# EAGLE schematic pdp8i (EAGLE 6.6.0), part 4 of 4
## Sheet 30 of 40
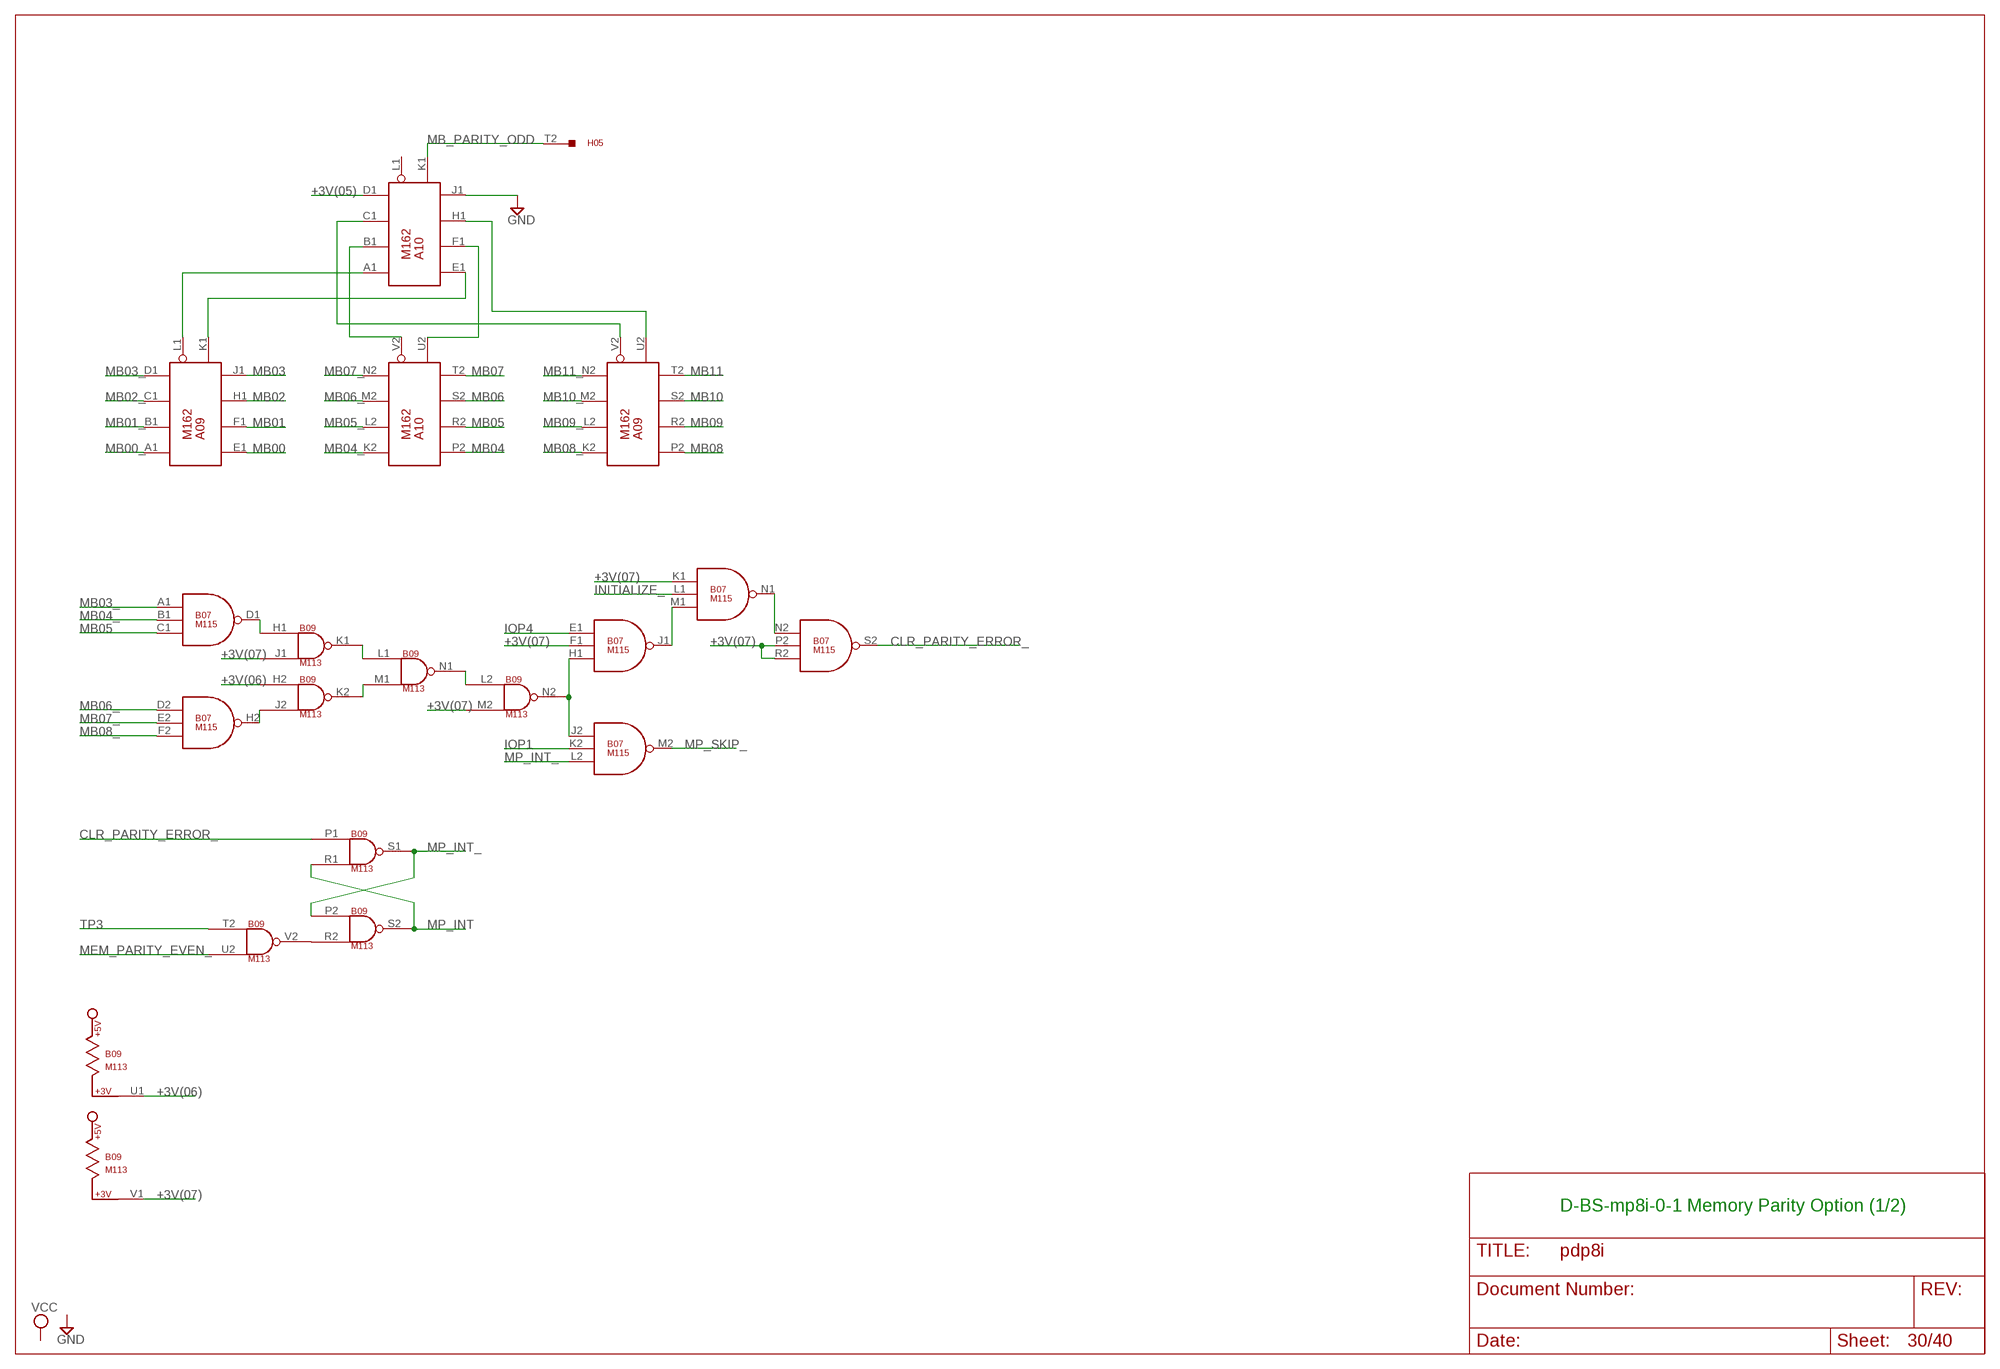
[diagram p30: schematic, sheet 30]

### Parts
A09  M162  [H807]
A10  M162  [H807]
B07  M115  [H807]
B09  M113  [H807]

### Nets
+3V(05): A10.D1(K1:8B) ; also sheet 31
+3V(06): B09.H2(K2:IN1) B09.U1 ; also sheet 31
+3V(07): B07.F1(J1:IN2) B07.K1(N1:IN1) B07.P2(S2:IN2) B07.R2(S2:IN3) B09.J1(K1:IN2) B09.M2(N2:IN2) B09.V1
CLR_PARITY_ERROR_: B07.S2(S2:OUT) B09.P1(S1:IN1)
GND [Suppply]: A10.J1(K1:8A) ; also sheet 2,5,9,10,11,12,13,14,15,17,18,23,26,27,33,34,35,39
INITIALIZE_: B07.L1(N1:IN2) ; also sheet 2,14,26,32,35,36,37,38,39
IOP1: B07.K2(M2:IN2) ; also sheet 2,15,16,33,34,35,36
IOP4: B07.E1(J1:IN1) ; also sheet 2,15,16,33,34,35,36
MB00: A09.E1(K1:1A) ; also sheet 9,14,21
MB00_: A09.A1(K1:1B) ; also sheet 9,18,23
MB01: A09.F1(K1:2A) ; also sheet 9,14,21
MB01_: A09.B1(K1:2B) ; also sheet 9,18,23
MB02: A09.H1(K1:4A) ; also sheet 9,14,21
MB02_: A09.C1(K1:4B) ; also sheet 9,18,23
MB03: A09.J1(K1:8A) ; also sheet 4,5,9,14,21,27,29,34,38
MB03_: A09.D1(K1:8B) B07.A1(D1:IN1) ; also sheet 4,5,6,7,8,9,14,15,16,18,22,23,32,33,35,36,37
MB04: A10.P2(U2:1A) ; also sheet 5,9,14,21,22,38
MB04_: A10.K2(U2:1B) B07.B1(D1:IN2) ; also sheet 5,8,9,14,15,16,18,23,27,29,32,33,34,35,36,37
MB05: A10.R2(U2:2A) B07.C1(D1:IN3) ; also sheet 5,7,9,14,21,27,32,34,37
MB05_: A10.L2(U2:2B) ; also sheet 5,8,9,14,15,16,18,22,23,29,33,35,36,38
MB06: A10.S2(U2:4A) ; also sheet 5,7,9,14,16,21,22,27,33,38
MB06_: A10.M2(U2:4B) B07.D2(H2:IN1) ; also sheet 5,8,9,14,15,18,22,23,29,32,34,35,36,37,38
MB07: A10.T2(U2:8A) ; also sheet 5,7,9,14,15,21,22,26,27,33,34,35,37,38
MB07_: A10.N2(U2:8B) B07.E2(H2:IN2) ; also sheet 5,8,9,14,16,18,22,23,26,28,29,32,33,34,36
MB08: A09.P2(U2:1A) ; also sheet 6,7,9,14,15,21,22,26,27,33,34,36,37,38
MB08_: A09.K2(U2:1B) B07.F2(H2:IN3) ; also sheet 6,7,8,9,14,16,18,22,23,26,28,29,32,33,34,35
MB09: A09.R2(U2:2A) ; also sheet 2,5,6,9,14,21,22,27,29,37
MB09_: A09.L2(U2:2B) ; also sheet 6,9,18,23,26,27,28,33,37
MB10: A09.S2(U2:4A) ; also sheet 2,6,8,9,14,21,22,27,29,33,37
MB10_: A09.M2(U2:4B) ; also sheet 6,8,9,18,22,23,26,27,28,37
MB11: A09.T2(U2:8A) ; also sheet 2,6,9,14,21,22,27,29,33,37
MB11_: A09.N2(U2:8B) ; also sheet 2,5,7,8,9,18,22,23,26,28,29
MB_PARITY_ODD: A10.K1(K1:ODD) H05.T2 ; also sheet 18
MEM_PARITY_EVEN_: B09.U2(V2:IN2) ; also sheet 31
MP_INT: B09.R1(S1:IN2) B09.S2(S2:OUT)
MP_INT_: B07.L2(M2:IN3) B09.P2(S2:IN1) B09.S1(S1:OUT) ; also sheet 14
MP_SKIP_: B07.M2(M2:OUT) ; also sheet 14
N$262: A09.L1(K1:EVEN) A10.A1(K1:1B)
N$687: A09.K1(K1:ODD) A10.E1(K1:1A)
N$689: A10.B1(K1:2B) A10.V2(U2:EVEN)
N$690: A10.F1(K1:2A) A10.U2(U2:ODD)
N$691: A09.V2(U2:EVEN) A10.C1(K1:4B)
N$692: A09.U2(U2:ODD) A10.H1(K1:4A)
N$693: B07.D1(D1:OUT) B09.H1(K1:IN1)
N$694: B07.H2(H2:OUT) B09.J2(K2:IN2)
N$695: B09.K1(K1:OUT) B09.L1(N1:IN1)
N$696: B09.K2(K2:OUT) B09.M1(N1:IN2)
N$697: B07.H1(J1:IN3) B07.J2(M2:IN1) B09.N2(N2:OUT)
N$698: B09.L2(N2:IN1) B09.N1(N1:OUT)
N$699: B07.J1(J1:OUT) B07.M1(N1:IN3)
N$700: B07.N1(N1:OUT) B07.N2(S2:IN1)
N$701: B09.R2(S2:IN2) B09.V2(V2:OUT)
TP3: B09.T2(V2:IN1) ; also sheet 2,7,21,22,26,27,29
Unconnected: A10.L1(K1:EVEN) B07.P1(U1:IN1) B07.R1(U1:IN2) B07.S1(U1:IN3) B07.T2(V1:IN1) B07.U1(U1:OUT) B07.U2(V1:IN2) B07.V1(V1:OUT) B07.V2(V1:IN3)

### Notes on the sheet
- D-BS-mp8i-0-1 Memory Parity Option (1/2)

## Sheet 31 of 40
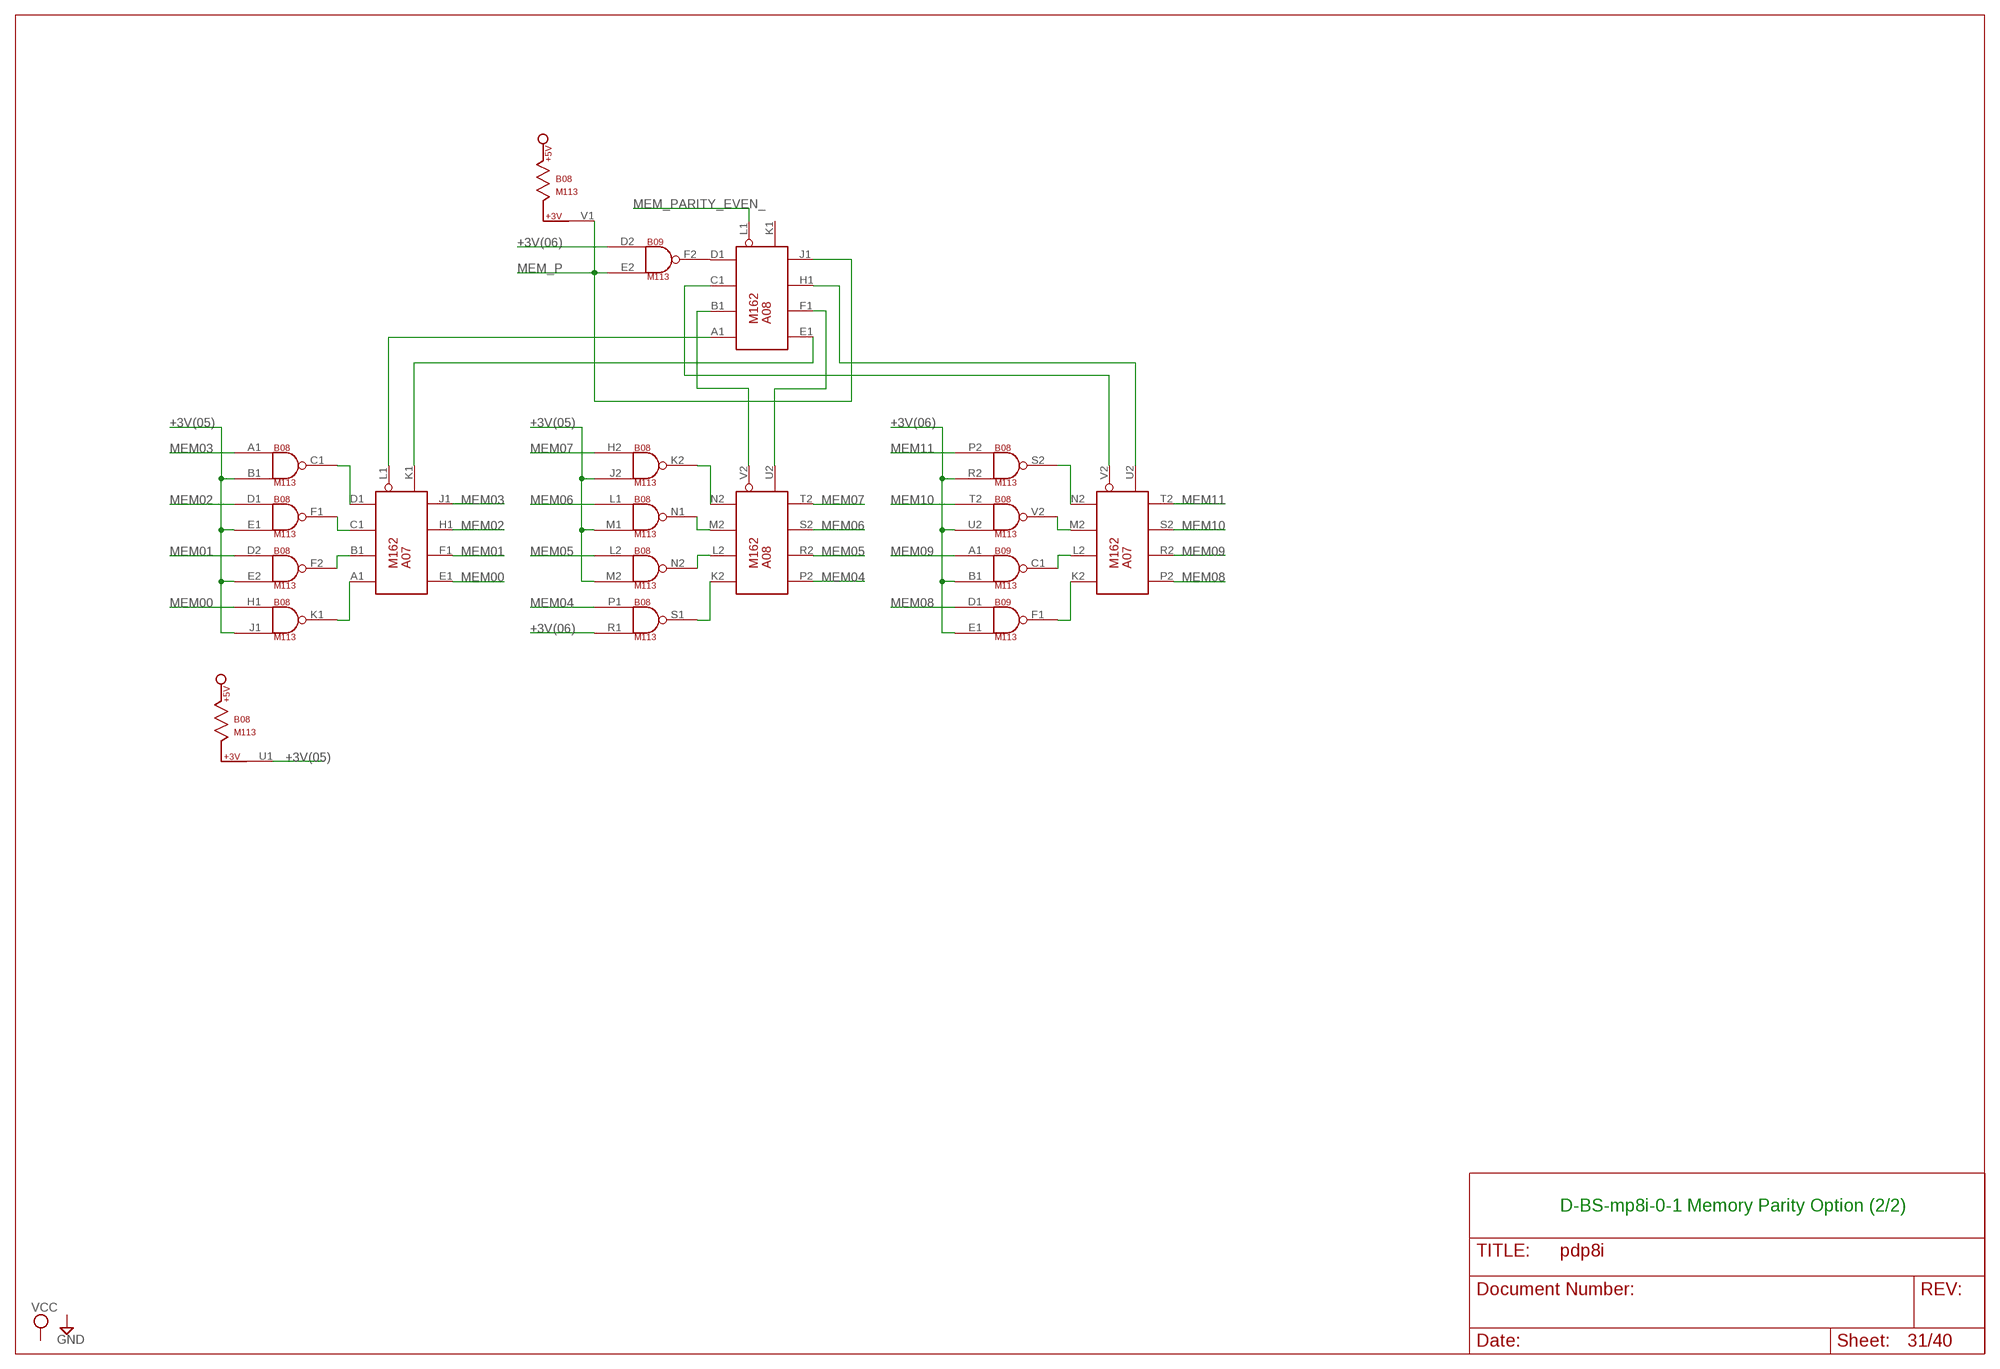
[diagram p31: schematic, sheet 31]

### Parts
A07  M162  [H807]
A08  M162  [H807]
B08  M113  [H807]

### Nets
+3V(05): B08.B1(C1:IN2) B08.E1(F1:IN2) B08.E2(F2:IN2) B08.J1(K1:IN2) B08.J2(K2:IN2) B08.M1(N1:IN2) B08.M2(N2:IN2) B08.U1 ; also sheet 30
+3V(06): B08.R1(S1:IN2) B08.R2(S2:IN2) B08.U2(V2:IN2) B09.B1(C1:IN2) B09.D2(F2:IN1) B09.E1(F1:IN2) ; also sheet 30
MEM00: A07.E1(K1:1A) B08.H1(K1:IN1) ; also sheet 4,10,18,29
MEM01: A07.F1(K1:2A) B08.D2(F2:IN1) ; also sheet 4,10,18
MEM02: A07.H1(K1:4A) B08.D1(F1:IN1) ; also sheet 4,10,18
MEM03: A07.J1(K1:8A) B08.A1(C1:IN1) ; also sheet 11,18
MEM04: A08.P2(U2:1A) B08.P1(S1:IN1) ; also sheet 11,18
MEM05: A08.R2(U2:2A) B08.L2(N2:IN1) ; also sheet 11,18
MEM06: A08.S2(U2:4A) B08.L1(N1:IN1) ; also sheet 12,18
MEM07: A08.T2(U2:8A) B08.H2(K2:IN1) ; also sheet 12,18
MEM08: A07.P2(U2:1A) B09.D1(F1:IN1) ; also sheet 12,18
MEM09: A07.R2(U2:2A) B09.A1(C1:IN1) ; also sheet 13,18,29
MEM10: A07.S2(U2:4A) B08.T2(V2:IN1) ; also sheet 13,18
MEM11: A07.T2(U2:8A) B08.P2(S2:IN1) ; also sheet 13,18
MEM_P: A08.J1(K1:8A) B08.V1 B09.E2(F2:IN2) ; also sheet 18
MEM_PARITY_EVEN_: A08.L1(K1:EVEN) ; also sheet 30
N$702: A07.L1(K1:EVEN) A08.A1(K1:1B)
N$703: A07.K1(K1:ODD) A08.E1(K1:1A)
N$704: A08.B1(K1:2B) A08.V2(U2:EVEN)
N$705: A08.F1(K1:2A) A08.U2(U2:ODD)
N$706: A07.V2(U2:EVEN) A08.C1(K1:4B)
N$707: A07.U2(U2:ODD) A08.H1(K1:4A)
N$708: A08.M2(U2:4B) B08.N1(N1:OUT)
N$709: A08.L2(U2:2B) B08.N2(N2:OUT)
N$710: A08.K2(U2:1B) B08.S1(S1:OUT)
N$711: A08.N2(U2:8B) B08.K2(K2:OUT)
N$712: A07.M2(U2:4B) B08.V2(V2:OUT)
N$713: A07.B1(K1:2B) B08.F2(F2:OUT)
N$714: A07.C1(K1:4B) B08.F1(F1:OUT)
N$715: A07.D1(K1:8B) B08.C1(C1:OUT)
N$716: A07.A1(K1:1B) B08.K1(K1:OUT)
N$717: A07.L2(U2:2B) B09.C1(C1:OUT)
N$718: A07.K2(U2:1B) B09.F1(F1:OUT)
N$719: A07.N2(U2:8B) B08.S2(S2:OUT)
N$720: A08.D1(K1:8B) B09.F2(F2:OUT)
Unconnected: A08.K1(K1:ODD)

### Notes on the sheet
- D-BS-mp8i-0-1 Memory Parity Option (2/2)

## Sheet 32 of 40
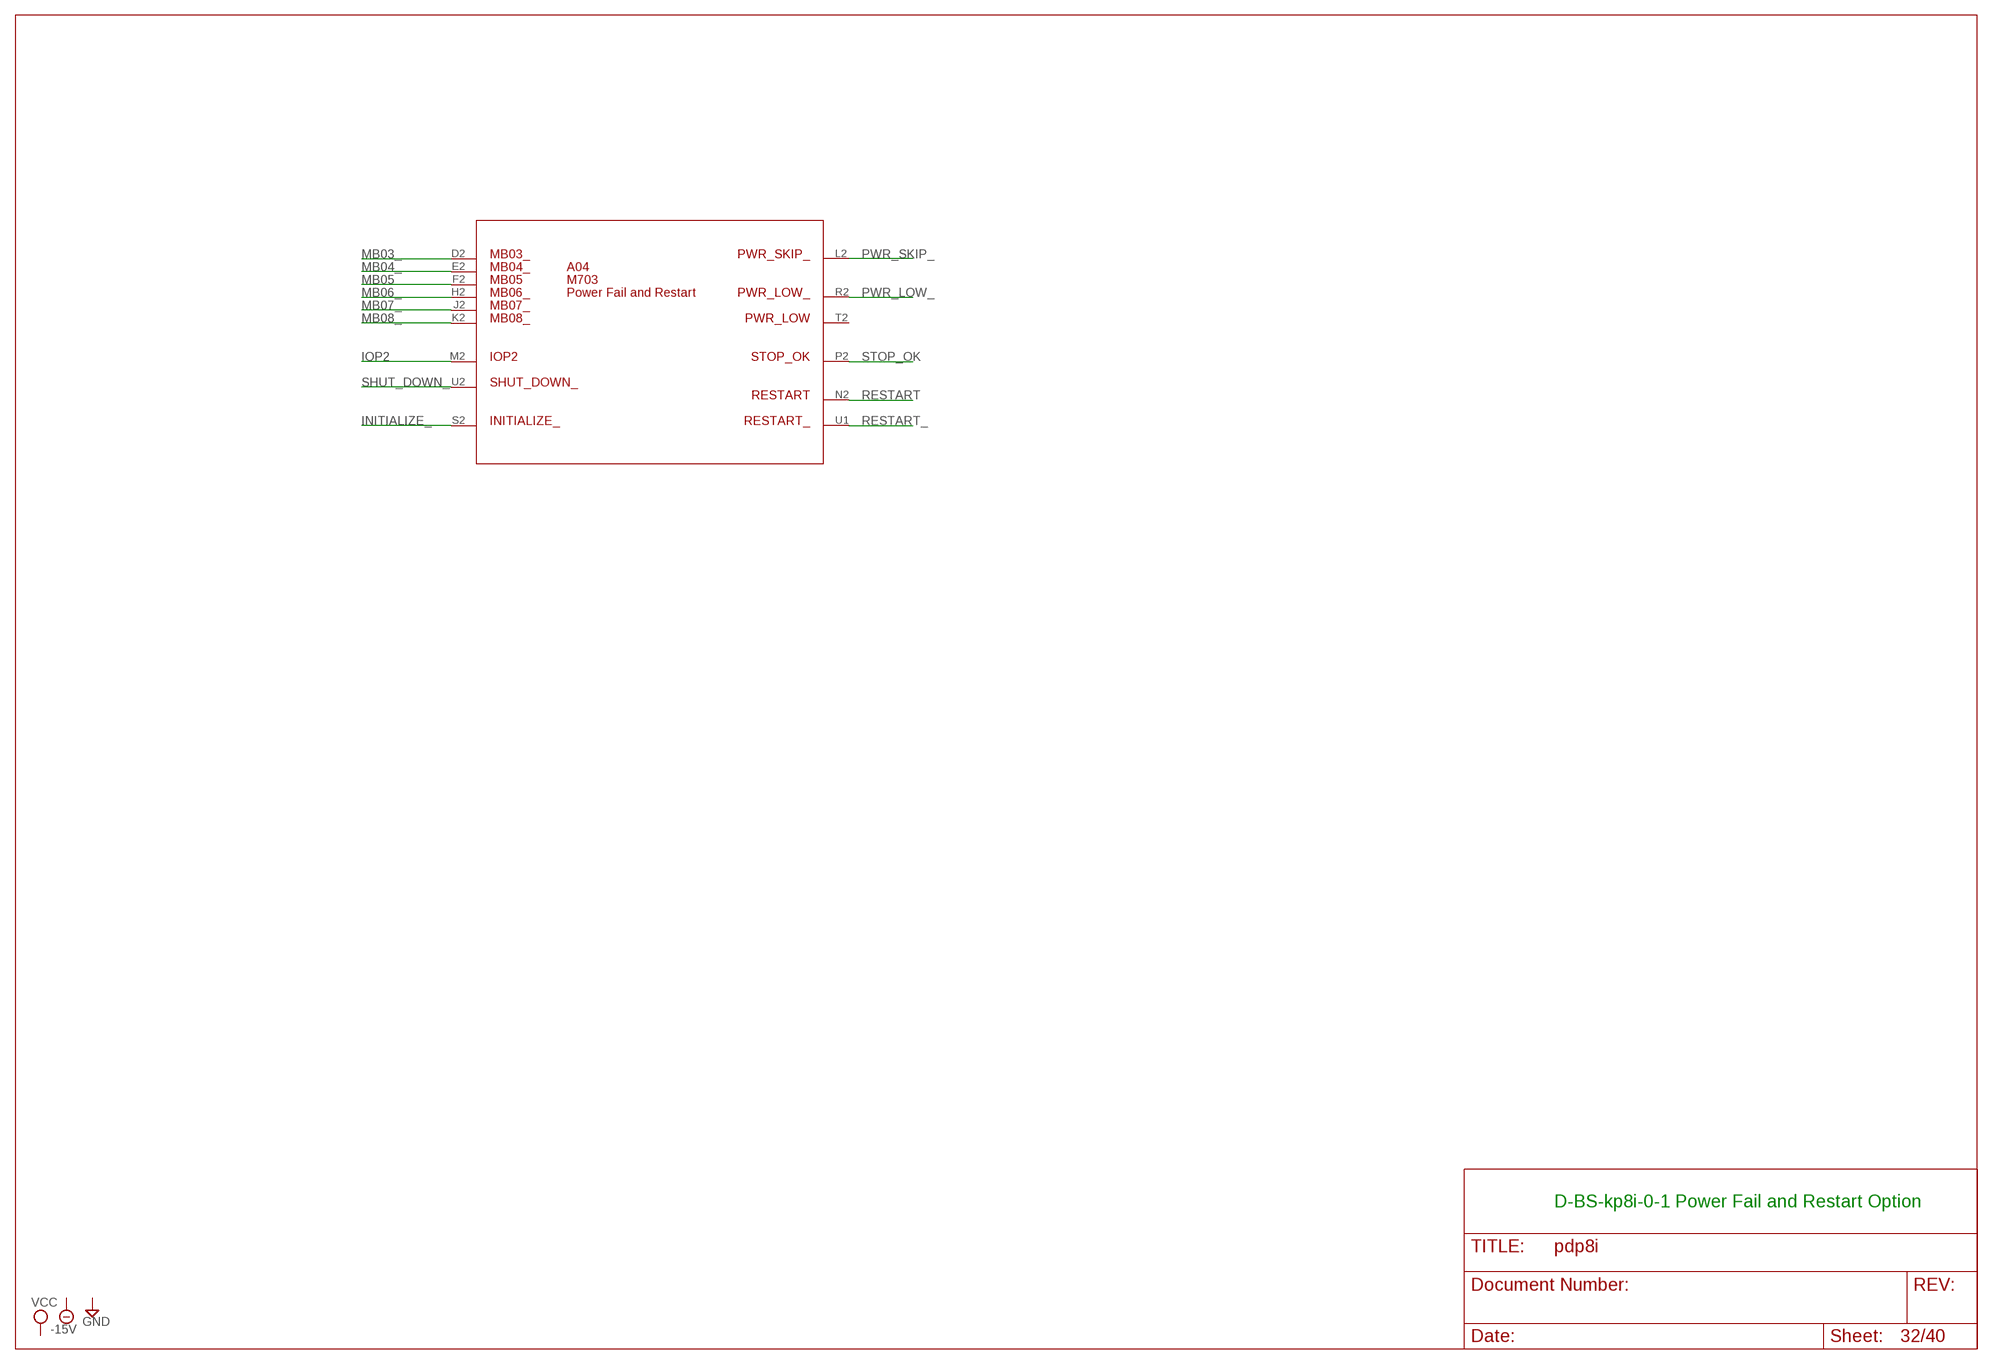
[diagram p32: schematic, sheet 32]

### Parts
A04  M703  [H807]

### Nets
INITIALIZE_: A04.S2 ; also sheet 2,14,26,30,35,36,37,38,39
IOP2: A04.M2 ; also sheet 2,15,16,33,34,35,36
MB03_: A04.D2 ; also sheet 4,5,6,7,8,9,14,15,16,18,22,23,30,33,35,36,37
MB04_: A04.E2 ; also sheet 5,8,9,14,15,16,18,23,27,29,30,33,34,35,36,37
MB05: A04.F2 ; also sheet 5,7,9,14,21,27,30,34,37
MB06_: A04.H2 ; also sheet 5,8,9,14,15,18,22,23,29,30,34,35,36,37,38
MB07_: A04.J2 ; also sheet 5,8,9,14,16,18,22,23,26,28,29,30,33,34,36
MB08_: A04.K2 ; also sheet 6,7,8,9,14,16,18,22,23,26,28,29,30,33,34,35
PWR_LOW_: A04.R2 ; also sheet 16
PWR_SKIP_: A04.L2 ; also sheet 16
RESTART: A04.N2 ; also sheet 21
RESTART_: A04.U1 ; also sheet 2,5
SHUT_DOWN_: A04.U2 ; also sheet 17
STOP_OK: A04.P2 ; also sheet 2,17
Unconnected: A04.T2

### Notes on the sheet
- D-BS-kp8i-0-1 Power Fail and Restart Option

## Sheet 33 of 40
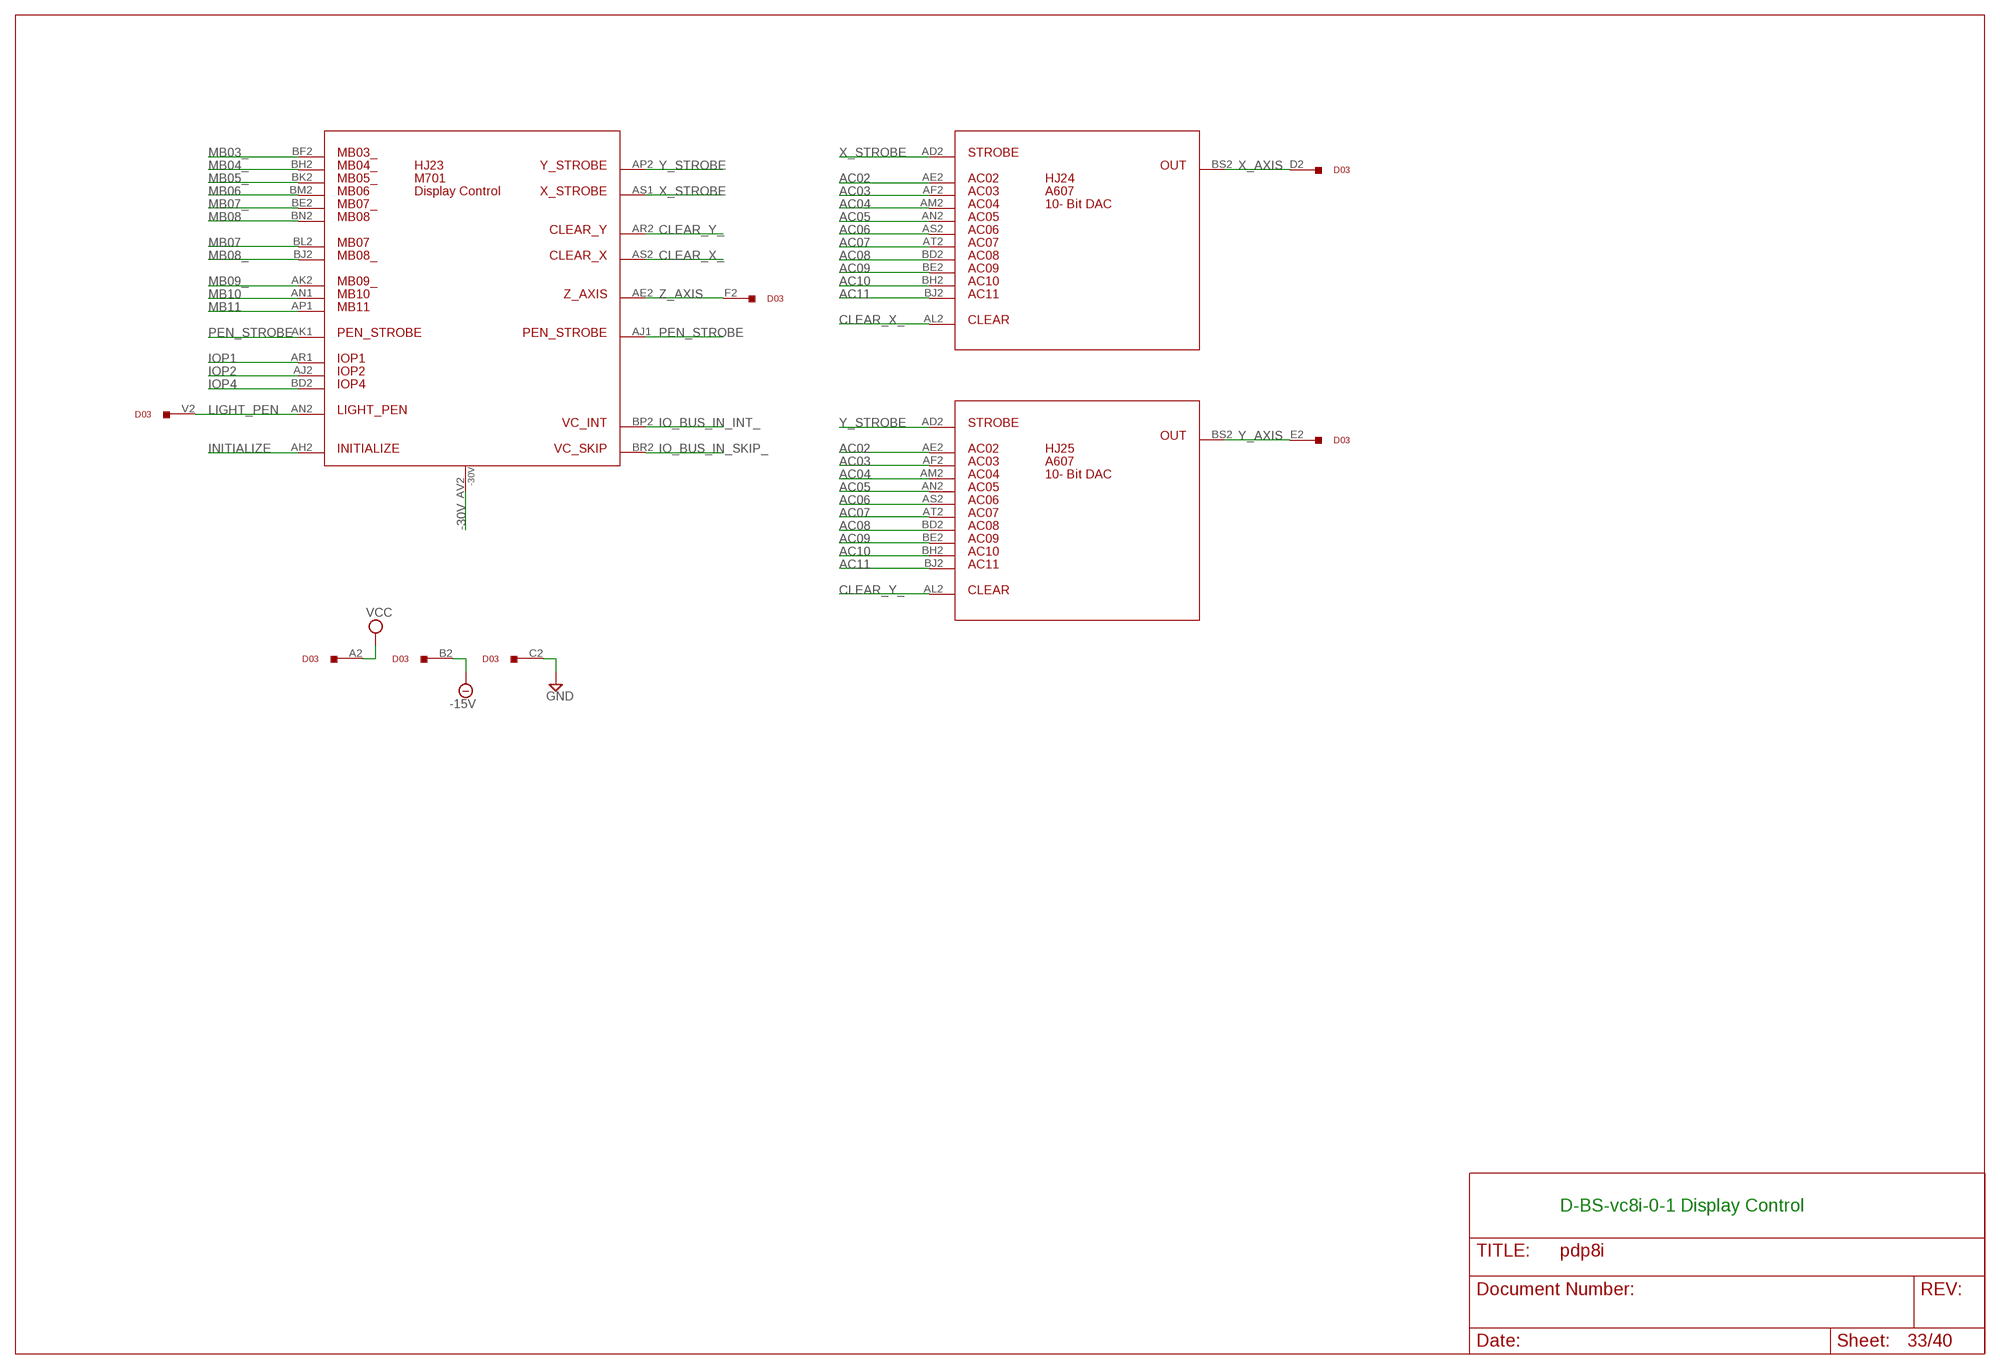
[diagram p33: schematic, sheet 33]

### Parts
D03  W023  [H807]
HJ23  M701  [H807-2]
HJ24  A607  [H807-2]
HJ25  A607  [H807-2]

### Nets
-15V [Suppply]: D03.B2 ; also sheet 17,36
-30V [Suppply]: HJ23.AV2(-30V) ; also sheet 15,17,18,23
AC02: HJ24.AE2 HJ25.AE2 ; also sheet 9,14,27,28,37
AC03: HJ24.AF2 HJ25.AF2 ; also sheet 9,14,28,37
AC04: HJ24.AM2 HJ25.AM2 ; also sheet 9,14,16,28,35,37
AC05: HJ24.AN2 HJ25.AN2 ; also sheet 9,14,16,28,35,37
AC06: HJ24.AS2 HJ25.AS2 ; also sheet 9,14,16,28,35,37
AC07: HJ24.AT2 HJ25.AT2 ; also sheet 9,14,16,28,35,37
AC08: HJ24.BD2 HJ25.BD2 ; also sheet 9,14,16,28,35,37
AC09: HJ24.BE2 HJ25.BE2 ; also sheet 9,14,16,28,35,37
AC10: HJ24.BH2 HJ25.BH2 ; also sheet 9,14,16,28,35,37
AC11: HJ24.BJ2 HJ25.BJ2 ; also sheet 9,14,16,28,35,37
CLEAR_X_: HJ23.AS2 HJ24.AL2
CLEAR_Y_: HJ23.AR2 HJ25.AL2
GND [Suppply]: D03.C2 ; also sheet 2,5,9,10,11,12,13,14,15,17,18,23,26,27,30,34,35,39
INITIALIZE: HJ23.AH2 ; also sheet 2,15,16,34,36
IO_BUS_IN_INT_: HJ23.BP2 ; also sheet 14,34,35,36,37,38
IO_BUS_IN_SKIP_: HJ23.BR2 ; also sheet 14,34,35,36,37,38
IOP1: HJ23.AR1 ; also sheet 2,15,16,30,34,35,36
IOP2: HJ23.AJ2 ; also sheet 2,15,16,32,34,35,36
IOP4: HJ23.BD2 ; also sheet 2,15,16,30,34,35,36
LIGHT_PEN: D03.V2 HJ23.AN2
MB03_: HJ23.BF2 ; also sheet 4,5,6,7,8,9,14,15,16,18,22,23,30,32,35,36,37
MB04_: HJ23.BH2 ; also sheet 5,8,9,14,15,16,18,23,27,29,30,32,34,35,36,37
MB05_: HJ23.BK2 ; also sheet 5,8,9,14,15,16,18,22,23,29,30,35,36,38
MB06: HJ23.BM2 ; also sheet 5,7,9,14,16,21,22,27,30,38
MB07: HJ23.BL2 ; also sheet 5,7,9,14,15,21,22,26,27,30,34,35,37,38
MB07_: HJ23.BE2 ; also sheet 5,8,9,14,16,18,22,23,26,28,29,30,32,34,36
MB08: HJ23.BN2 ; also sheet 6,7,9,14,15,21,22,26,27,30,34,36,37,38
MB08_: HJ23.BJ2 ; also sheet 6,7,8,9,14,16,18,22,23,26,28,29,30,32,34,35
MB09_: HJ23.AK2 ; also sheet 6,9,18,23,26,27,28,30,37
MB10: HJ23.AN1 ; also sheet 2,6,8,9,14,21,22,27,29,30,37
MB11: HJ23.AP1 ; also sheet 2,6,9,14,21,22,27,29,30,37
PEN_STROBE: HJ23.AJ1 HJ23.AK1
VCC [Suppply]: D03.A2 ; also sheet 9,12
X_AXIS: D03.D2 HJ24.BS2
X_STROBE: HJ23.AS1 HJ24.AD2
Y_AXIS: D03.E2 HJ25.BS2
Y_STROBE: HJ23.AP2 HJ25.AD2
Z_AXIS: D03.F2 HJ23.AE2
Unconnected: D03.H2 D03.J2 D03.K2 D03.L2 D03.M2 D03.N2 D03.P2 D03.R2 D03.S2 D03.T2 D03.U2

### Notes on the sheet
- D-BS-vc8i-0-1 Display Control

## Sheet 34 of 40
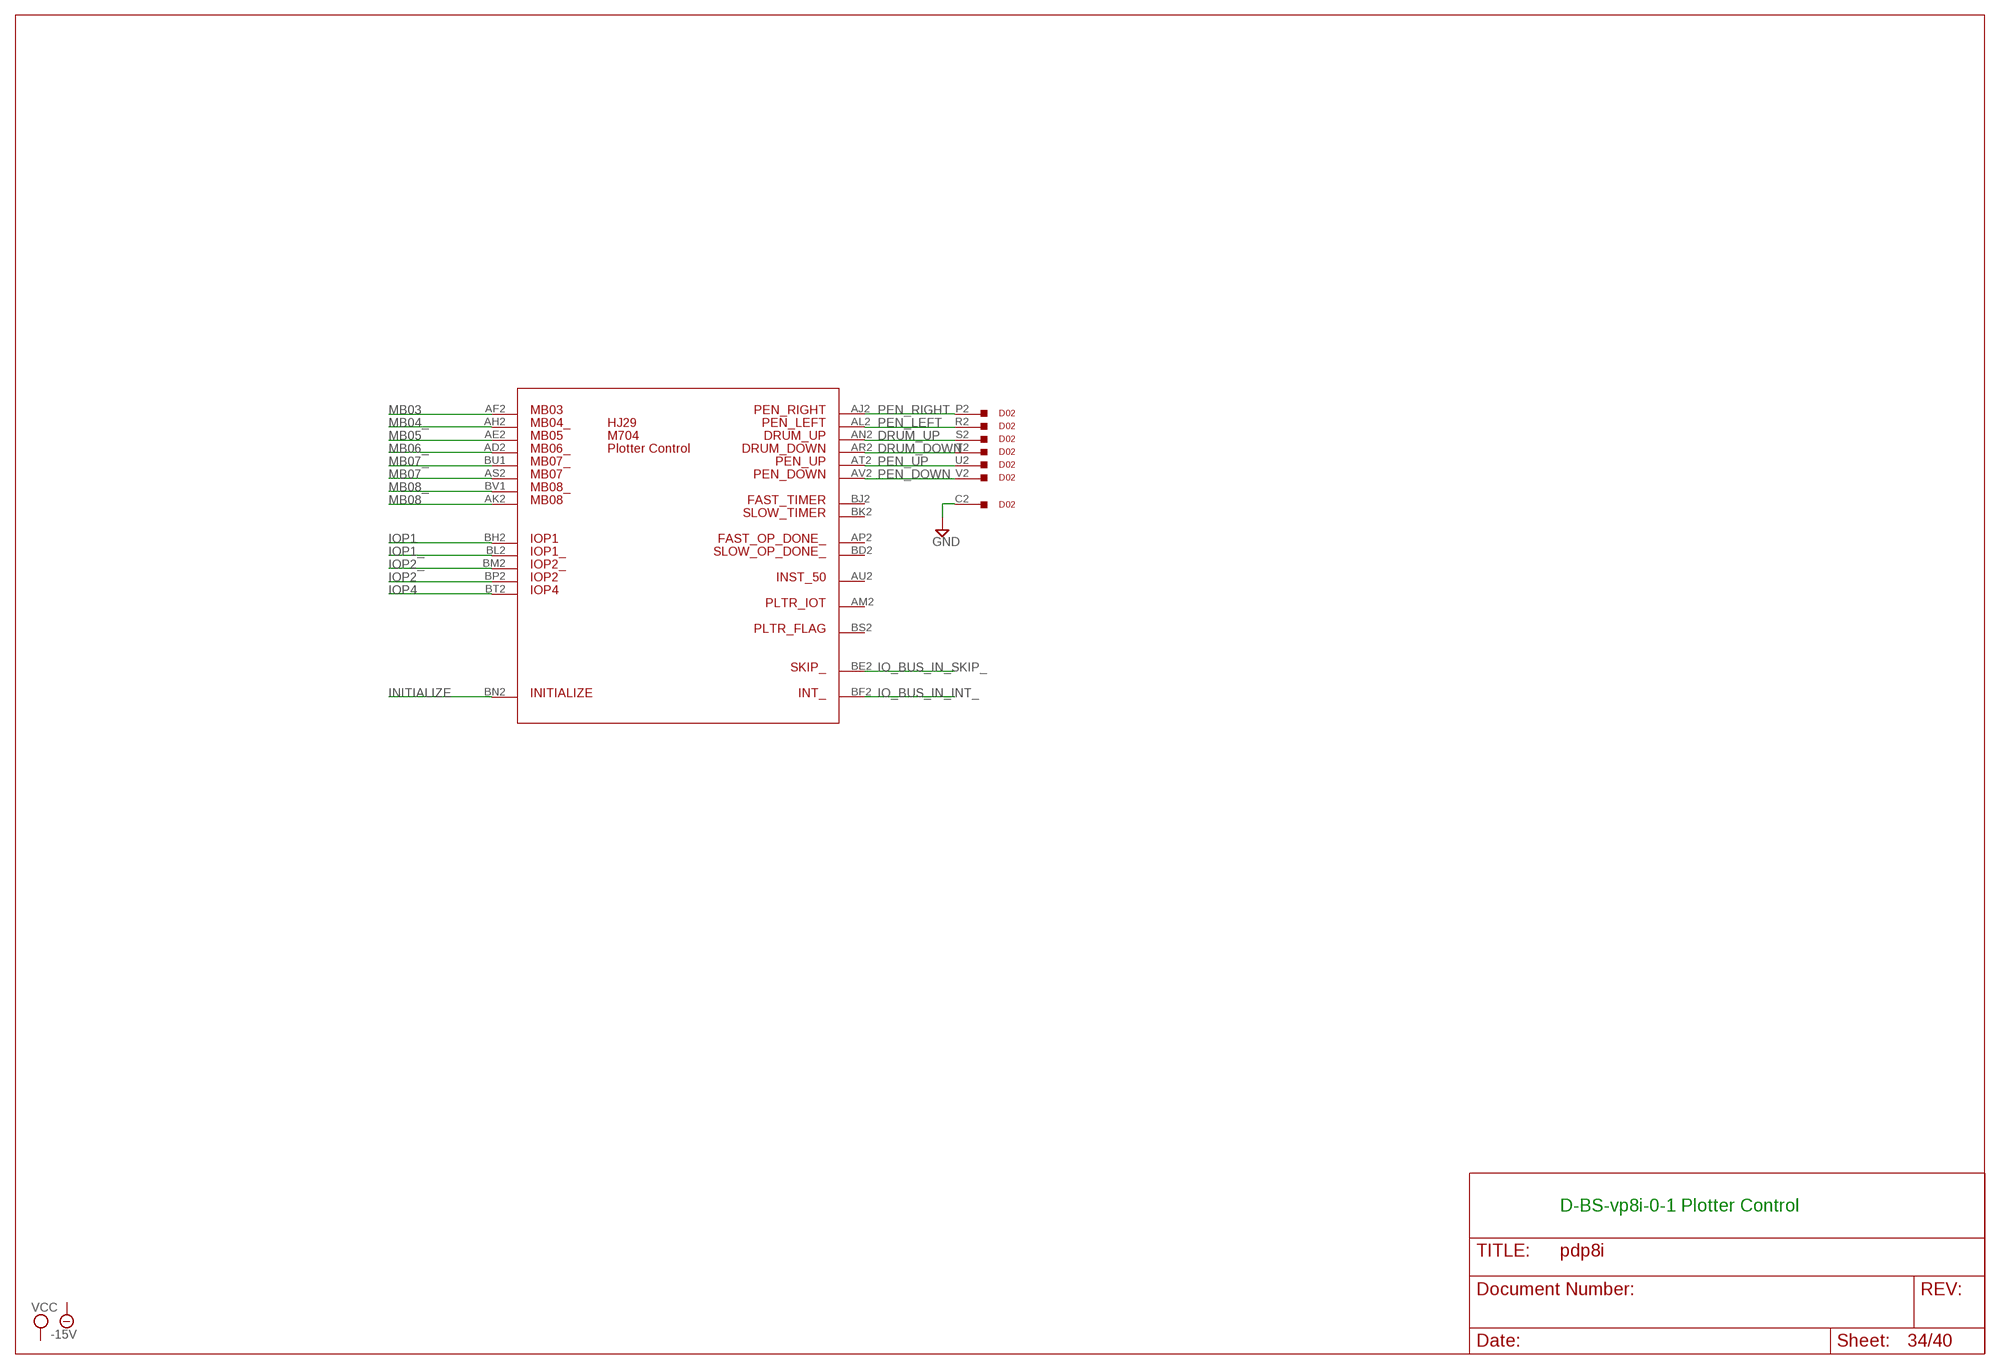
[diagram p34: schematic, sheet 34]

### Parts
D02  W023  [H807]
HJ29  M704  [H807-2]

### Nets
DRUM_DOWN: D02.T2 HJ29.AR2
DRUM_UP: D02.S2 HJ29.AN2
GND [Suppply]: D02.C2 ; also sheet 2,5,9,10,11,12,13,14,15,17,18,23,26,27,30,33,35,39
INITIALIZE: HJ29.BN2 ; also sheet 2,15,16,33,36
IO_BUS_IN_INT_: HJ29.BF2 ; also sheet 14,33,35,36,37,38
IO_BUS_IN_SKIP_: HJ29.BE2 ; also sheet 14,33,35,36,37,38
IOP1: HJ29.BH2 ; also sheet 2,15,16,30,33,35,36
IOP1_: HJ29.BL2 ; also sheet 2,5,14,37
IOP2: HJ29.BP2 ; also sheet 2,15,16,32,33,35,36
IOP2_: HJ29.BM2 ; also sheet 2,5,14,37
IOP4: HJ29.BT2 ; also sheet 2,15,16,30,33,35,36
MB03: HJ29.AF2 ; also sheet 4,5,9,14,21,27,29,30,38
MB04_: HJ29.AH2 ; also sheet 5,8,9,14,15,16,18,23,27,29,30,32,33,35,36,37
MB05: HJ29.AE2 ; also sheet 5,7,9,14,21,27,30,32,37
MB06_: HJ29.AD2 ; also sheet 5,8,9,14,15,18,22,23,29,30,32,35,36,37,38
MB07: HJ29.AS2 ; also sheet 5,7,9,14,15,21,22,26,27,30,33,35,37,38
MB07_: HJ29.BU1 ; also sheet 5,8,9,14,16,18,22,23,26,28,29,30,32,33,36
MB08: HJ29.AK2 ; also sheet 6,7,9,14,15,21,22,26,27,30,33,36,37,38
MB08_: HJ29.BV1 ; also sheet 6,7,8,9,14,16,18,22,23,26,28,29,30,32,33,35
PEN_DOWN: D02.V2 HJ29.AV2
PEN_LEFT: D02.R2 HJ29.AL2
PEN_RIGHT: D02.P2 HJ29.AJ2
PEN_UP: D02.U2 HJ29.AT2
Unconnected: D02.A2 D02.B2 D02.D2 D02.E2 D02.F2 D02.H2 D02.J2 D02.K2 D02.L2 D02.M2 D02.N2 HJ29.AM2 HJ29.AP2 HJ29.AU2 HJ29.BD2 HJ29.BJ2 HJ29.BK2 HJ29.BS2

### Notes on the sheet
- D-BS-vp8i-0-1 Plotter Control

## Sheet 35 of 40
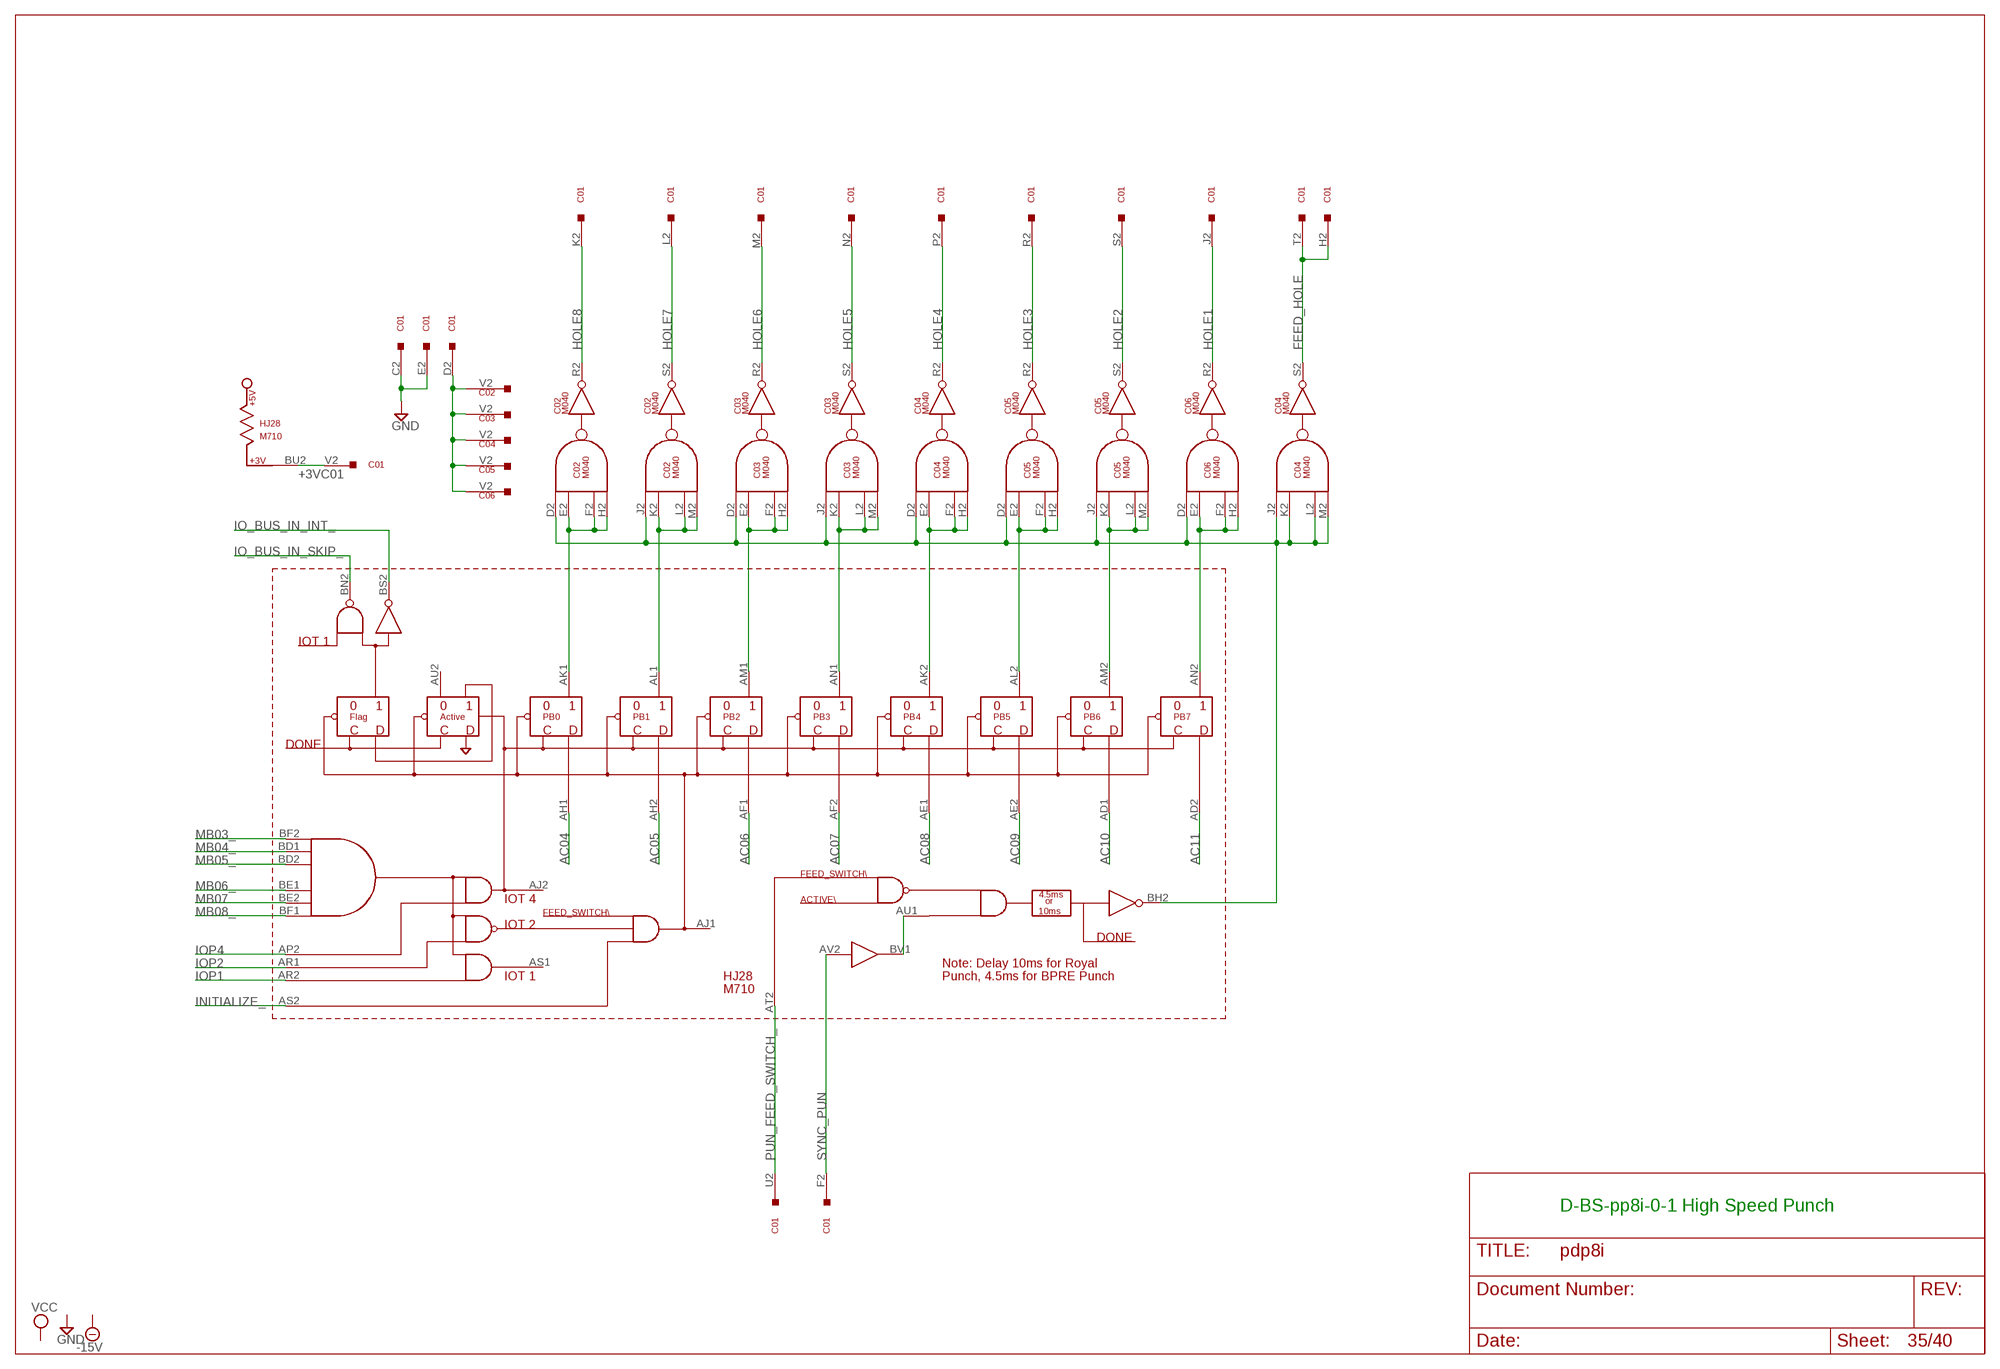
[diagram p35: schematic, sheet 35]

### Parts
C01  W023  [H807]
C02  M040  [H807]
C03  M040  [H807]
C04  M040  [H807]
C05  M040  [H807]
C06  M040  [H807]
HJ28  M710  [H807-2]

### Nets
+3VC01: C01.V2 HJ28.BU2
-36V: C01.D2 C02.V2 C03.V2 C04.V2 C05.V2 C06.V2
AC04: HJ28.AH1 ; also sheet 9,14,16,28,33,37
AC05: HJ28.AH2 ; also sheet 9,14,16,28,33,37
AC06: HJ28.AF1 ; also sheet 9,14,16,28,33,37
AC07: HJ28.AF2 ; also sheet 9,14,16,28,33,37
AC08: HJ28.AE1 ; also sheet 9,14,16,28,33,37
AC09: HJ28.AE2 ; also sheet 9,14,16,28,33,37
AC10: HJ28.AD1 ; also sheet 9,14,16,28,33,37
AC11: HJ28.AD2 ; also sheet 9,14,16,28,33,37
FEED_HOLE: C01.H2 C01.T2 C04.S2(R)
GND [Suppply]: C01.C2 C01.E2 ; also sheet 2,5,9,10,11,12,13,14,15,17,18,23,26,27,30,33,34,39
HOLE1: C01.J2 C06.R2(R)
HOLE2: C01.S2 C05.S2(R)
HOLE3: C01.R2 C05.R2(R)
HOLE4: C01.P2 C04.R2(R)
HOLE5: C01.N2 C03.S2(R)
HOLE6: C01.M2 C03.R2(R)
HOLE7: C01.L2 C02.S2(R)
HOLE8: C01.K2 C02.R2(R)
INITIALIZE_: HJ28.AS2 ; also sheet 2,14,26,30,32,36,37,38,39
IO_BUS_IN_INT_: HJ28.BS2 ; also sheet 14,33,34,36,37,38
IO_BUS_IN_SKIP_: HJ28.BN2 ; also sheet 14,33,34,36,37,38
IOP1: HJ28.AR2 ; also sheet 2,15,16,30,33,34,36
IOP2: HJ28.AR1 ; also sheet 2,15,16,32,33,34,36
IOP4: HJ28.AP2 ; also sheet 2,15,16,30,33,34,36
MB03_: HJ28.BF2 ; also sheet 4,5,6,7,8,9,14,15,16,18,22,23,30,32,33,36,37
MB04_: HJ28.BD1 ; also sheet 5,8,9,14,15,16,18,23,27,29,30,32,33,34,36,37
MB05_: HJ28.BD2 ; also sheet 5,8,9,14,15,16,18,22,23,29,30,33,36,38
MB06_: HJ28.BE1 ; also sheet 5,8,9,14,15,18,22,23,29,30,32,34,36,37,38
MB07: HJ28.BE2 ; also sheet 5,7,9,14,15,21,22,26,27,30,33,34,37,38
MB08_: HJ28.BF1 ; also sheet 6,7,8,9,14,16,18,22,23,26,28,29,30,32,33,34
N$721: HJ28.AU1 HJ28.BV1
N$722: C02.D2(D) C02.J2(D) C03.D2(D) C03.J2(D) C04.D2(D) C04.J2(D) C04.K2(E) C04.L2(F) C04.M2(H) C05.D2(D) C05.J2(D) C06.D2(D) HJ28.BH2
N$734: C02.E2(E) C02.F2(F) C02.H2(H) HJ28.AK1
N$735: C02.K2(E) C02.L2(F) C02.M2(H) HJ28.AL1
N$736: C06.E2(E) C06.F2(F) C06.H2(H) HJ28.AN2
N$737: C03.E2(E) C03.F2(F) C03.H2(H) HJ28.AM1
N$738: C03.K2(E) C03.L2(F) C03.M2(H) HJ28.AN1
N$739: C04.E2(E) C04.F2(F) C04.H2(H) HJ28.AK2
N$740: C05.E2(E) C05.F2(F) C05.H2(H) HJ28.AL2
N$741: C05.K2(E) C05.L2(F) C05.M2(H) HJ28.AM2
PUN_FEED_SWITCH_: C01.U2 HJ28.AT2
SYNC_PUN: C01.F2 HJ28.AV2
Unconnected: C01.A2 C01.B2 C06.J2(D) C06.K2(E) C06.L2(F) C06.M2(H) C06.S2(R) HJ28.AJ1 HJ28.AJ2 HJ28.AS1 HJ28.AU2

### Notes on the sheet
- IOT 4
- IOT 2
- IOT 1
- D-BS-pp8i-0-1 High Speed Punch

## Sheet 36 of 40
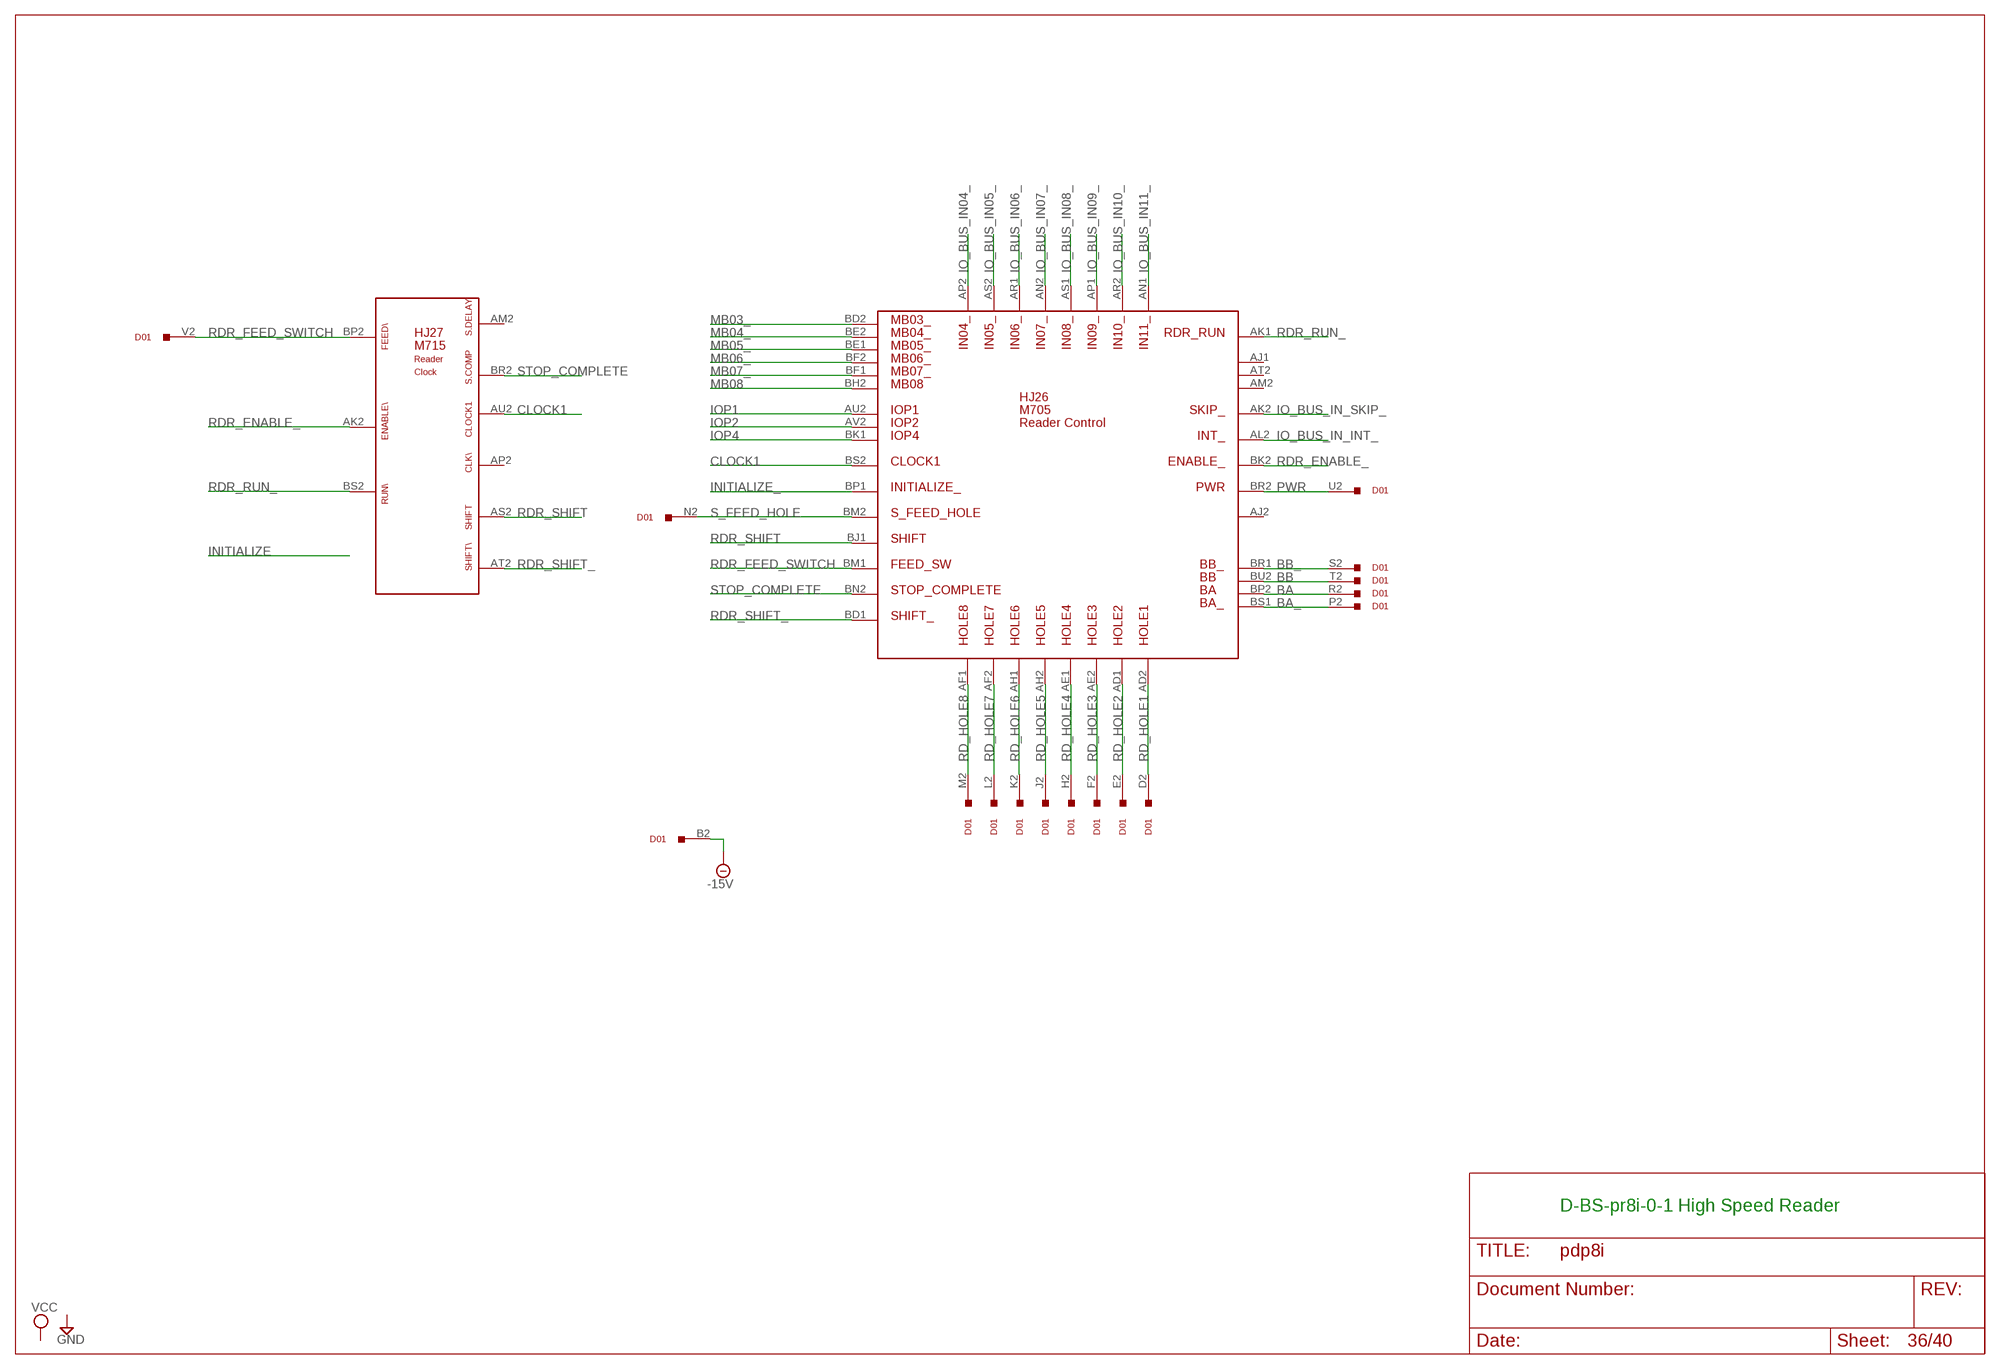
[diagram p36: schematic, sheet 36]

### Parts
D01  W077  W023  [H807]
HJ26  M705  [H807-2]
HJ27  M715  [H807-2]

### Nets
-15V [Suppply]: D01.B2 ; also sheet 17,33
BA: D01.R2 HJ26.BP2
BA_: D01.P2 HJ26.BS1
BB: D01.T2 HJ26.BU2
BB_: D01.S2 HJ26.BR1
CLOCK1: HJ26.BS2 HJ27.AU2(AU)
INITIALIZE_: HJ26.BP1 ; also sheet 2,14,26,30,32,35,37,38,39
IO_BUS_IN04_: HJ26.AP2 ; also sheet 14,37,39
IO_BUS_IN05_: HJ26.AS2 ; also sheet 14,37,39
IO_BUS_IN06_: HJ26.AR1 ; also sheet 14,37,39
IO_BUS_IN07_: HJ26.AN2 ; also sheet 14,37,39
IO_BUS_IN08_: HJ26.AS1 ; also sheet 14,37,39
IO_BUS_IN09_: HJ26.AP1 ; also sheet 14,37,39
IO_BUS_IN10_: HJ26.AR2 ; also sheet 14,37,39
IO_BUS_IN11_: HJ26.AN1 ; also sheet 14,37,39
IO_BUS_IN_INT_: HJ26.AL2 ; also sheet 14,33,34,35,37,38
IO_BUS_IN_SKIP_: HJ26.AK2 ; also sheet 14,33,34,35,37,38
IOP1: HJ26.AU2 ; also sheet 2,15,16,30,33,34,35
IOP2: HJ26.AV2 ; also sheet 2,15,16,32,33,34,35
IOP4: HJ26.BK1 ; also sheet 2,15,16,30,33,34,35
MB03_: HJ26.BD2 ; also sheet 4,5,6,7,8,9,14,15,16,18,22,23,30,32,33,35,37
MB04_: HJ26.BE2 ; also sheet 5,8,9,14,15,16,18,23,27,29,30,32,33,34,35,37
MB05_: HJ26.BE1 ; also sheet 5,8,9,14,15,16,18,22,23,29,30,33,35,38
MB06_: HJ26.BF2 ; also sheet 5,8,9,14,15,18,22,23,29,30,32,34,35,37,38
MB07_: HJ26.BF1 ; also sheet 5,8,9,14,16,18,22,23,26,28,29,30,32,33,34
MB08: HJ26.BH2 ; also sheet 6,7,9,14,15,21,22,26,27,30,33,34,37,38
PWR: D01.U2 HJ26.BR2
RD_HOLE1: D01.D2 HJ26.AD2
RD_HOLE2: D01.E2 HJ26.AD1
RD_HOLE3: D01.F2 HJ26.AE2
RD_HOLE4: D01.H2 HJ26.AE1
RD_HOLE5: D01.J2 HJ26.AH2
RD_HOLE6: D01.K2 HJ26.AH1
RD_HOLE7: D01.L2 HJ26.AF2
RD_HOLE8: D01.M2 HJ26.AF1
RDR_ENABLE_: HJ26.BK2 HJ27.AK2(AK)
RDR_FEED_SWITCH: D01.V2 HJ26.BM1 HJ27.BP2(BP)
RDR_RUN_: HJ26.AK1 HJ27.BS2(BS)
RDR_SHIFT: HJ26.BJ1 HJ27.AS2(AS)
RDR_SHIFT_: HJ26.BD1 HJ27.AT2(AT)
S_FEED_HOLE: D01.N2 HJ26.BM2
STOP_COMPLETE: HJ26.BN2 HJ27.BR2(BR)
Unconnected: D01.A2 D01.C2 HJ26.AJ1 HJ26.AJ2 HJ26.AM2 HJ26.AT2 HJ27.AM2(AM) HJ27.AP2(AP)

### Notes on the sheet
- D-BS-pr8i-0-1 High Speed Reader

## Sheet 37 of 40
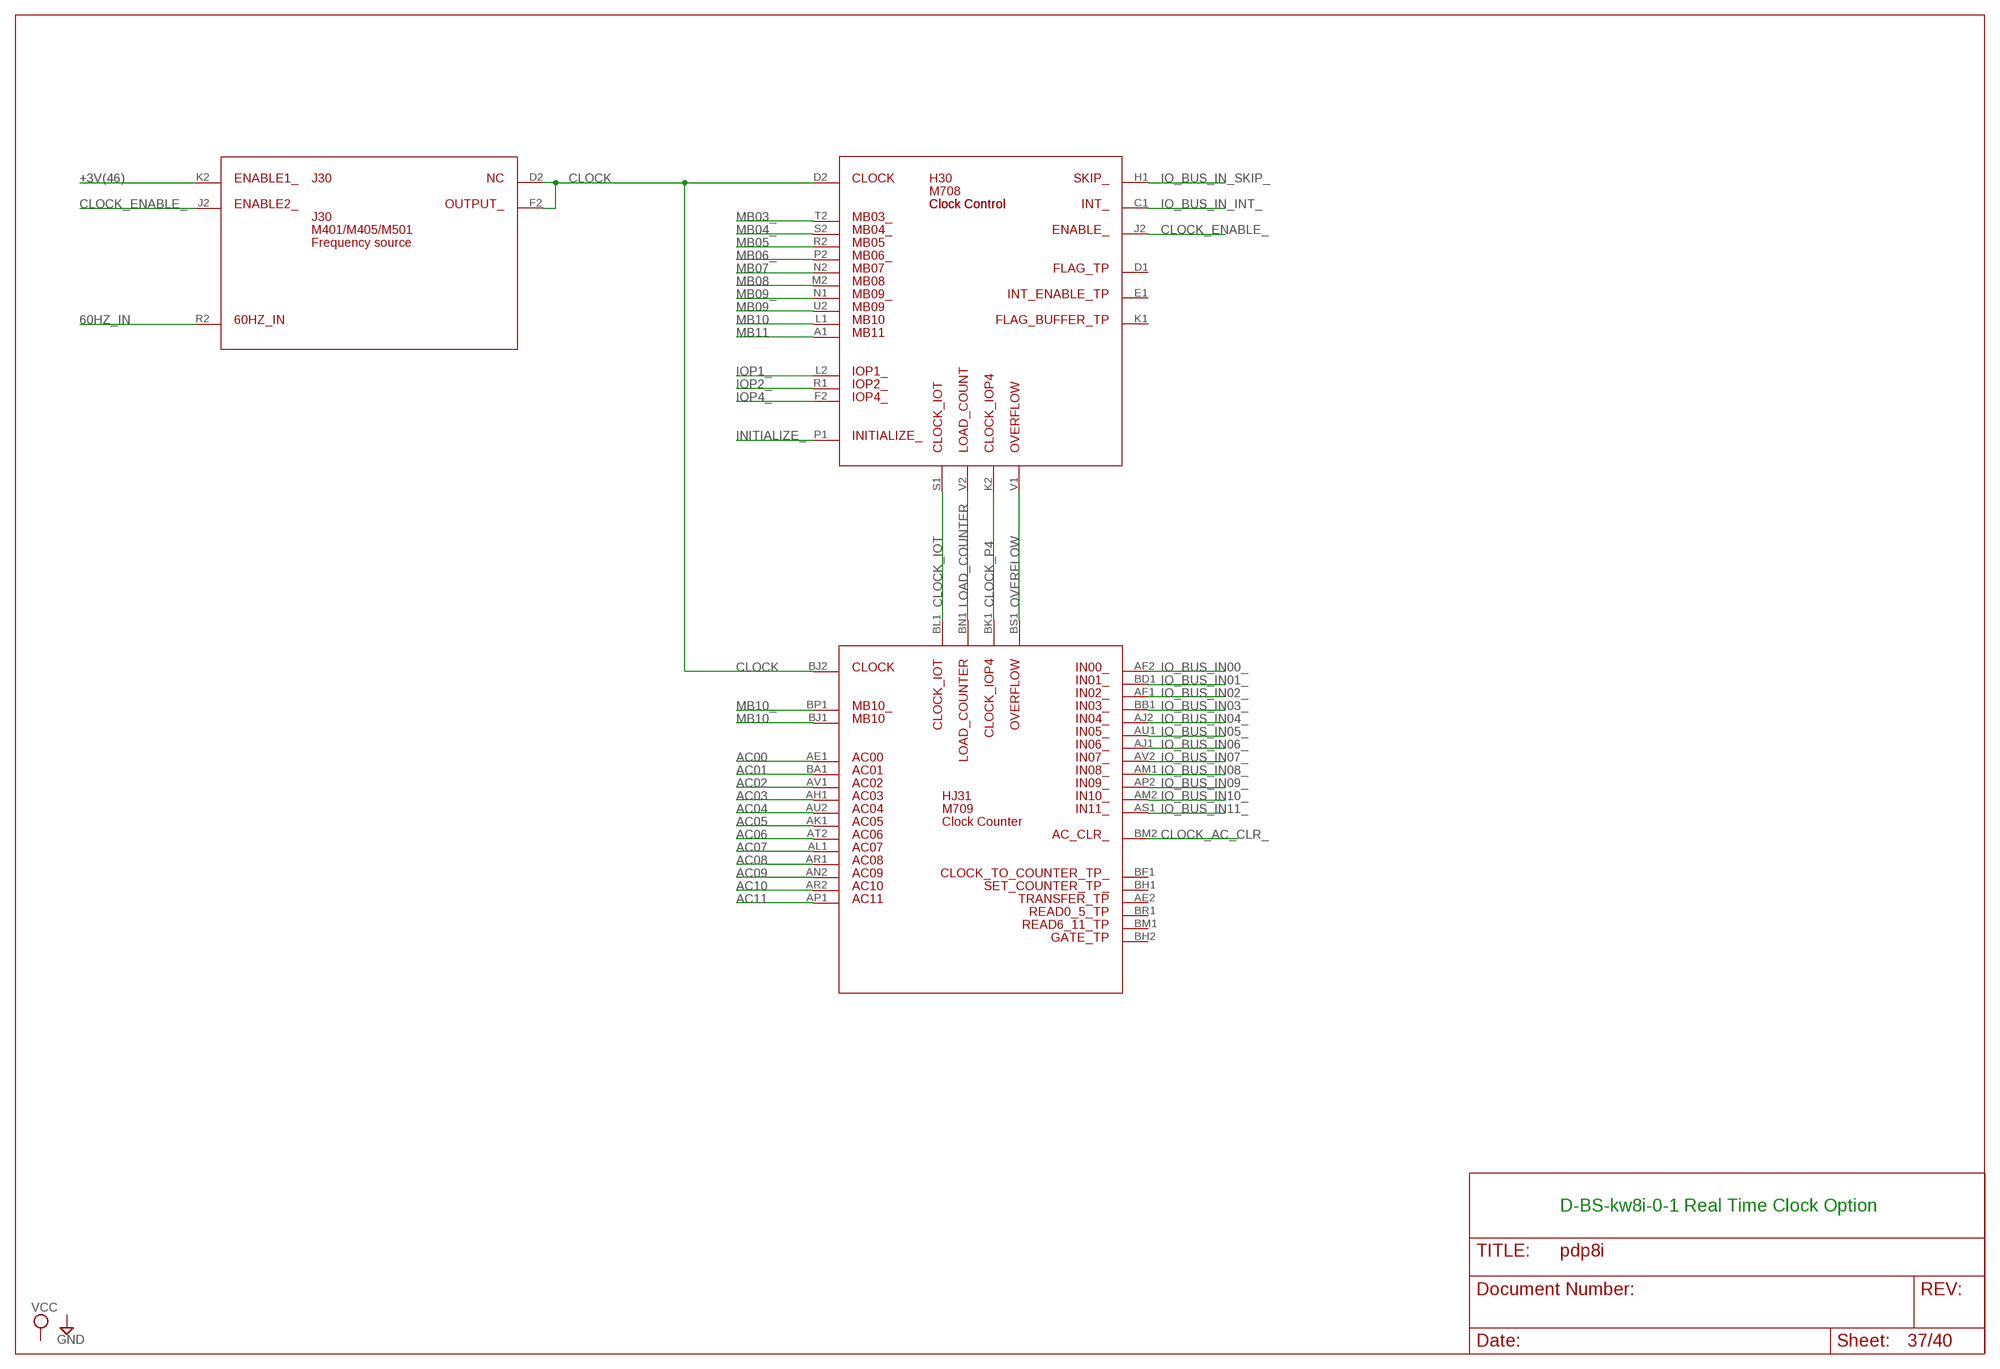
[diagram p37: schematic, sheet 37]

### Parts
H30  M708  [H807]
HJ31  M709  [H807-2]
J30  M401/M405/M501  M501  [H807]

### Nets
60HZ_IN: J30.R2
+3V(46): J30.K2 ; also sheet 1,2,5
AC00: HJ31.AE1 ; also sheet 7,9,14,27,28
AC01: HJ31.BA1 ; also sheet 9,14,27,28
AC02: HJ31.AV1 ; also sheet 9,14,27,28,33
AC03: HJ31.AH1 ; also sheet 9,14,28,33
AC04: HJ31.AU2 ; also sheet 9,14,16,28,33,35
AC05: HJ31.AK1 ; also sheet 9,14,16,28,33,35
AC06: HJ31.AT2 ; also sheet 9,14,16,28,33,35
AC07: HJ31.AL1 ; also sheet 9,14,16,28,33,35
AC08: HJ31.AR1 ; also sheet 9,14,16,28,33,35
AC09: HJ31.AN2 ; also sheet 9,14,16,28,33,35
AC10: HJ31.AR2 ; also sheet 9,14,16,28,33,35
AC11: HJ31.AP1 ; also sheet 9,14,16,28,33,35
CLOCK: H30.D2 HJ31.BJ2 J30.D2 J30.F2
CLOCK_AC_CLR_: HJ31.BM2 ; also sheet 14
CLOCK_ENABLE_: H30.J2 J30.J2
CLOCK_IOT: H30.S1 HJ31.BL1
CLOCK_P4: H30.K2 HJ31.BK1
INITIALIZE_: H30.P1 ; also sheet 2,14,26,30,32,35,36,38,39
IO_BUS_IN00_: HJ31.AF2 ; also sheet 14,39
IO_BUS_IN01_: HJ31.BD1 ; also sheet 14,39
IO_BUS_IN02_: HJ31.AF1 ; also sheet 14,39
IO_BUS_IN03_: HJ31.BB1 ; also sheet 14,39
IO_BUS_IN04_: HJ31.AJ2 ; also sheet 14,36,39
IO_BUS_IN05_: HJ31.AU1 ; also sheet 14,36,39
IO_BUS_IN06_: HJ31.AJ1 ; also sheet 14,36,39
IO_BUS_IN07_: HJ31.AV2 ; also sheet 14,36,39
IO_BUS_IN08_: HJ31.AM1 ; also sheet 14,36,39
IO_BUS_IN09_: HJ31.AP2 ; also sheet 14,36,39
IO_BUS_IN10_: HJ31.AM2 ; also sheet 14,36,39
IO_BUS_IN11_: HJ31.AS1 ; also sheet 14,36,39
IO_BUS_IN_INT_: H30.C1 ; also sheet 14,33,34,35,36,38
IO_BUS_IN_SKIP_: H30.H1 ; also sheet 14,33,34,35,36,38
IOP1_: H30.L2 ; also sheet 2,5,14,34
IOP2_: H30.R1 ; also sheet 2,5,14,34
IOP4_: H30.F2 ; also sheet 2,5,14
LOAD_COUNTER: H30.V2 HJ31.BN1
MB03_: H30.T2 ; also sheet 4,5,6,7,8,9,14,15,16,18,22,23,30,32,33,35,36
MB04_: H30.S2 ; also sheet 5,8,9,14,15,16,18,23,27,29,30,32,33,34,35,36
MB05: H30.R2 ; also sheet 5,7,9,14,21,27,30,32,34
MB06_: H30.P2 ; also sheet 5,8,9,14,15,18,22,23,29,30,32,34,35,36,38
MB07: H30.N2 ; also sheet 5,7,9,14,15,21,22,26,27,30,33,34,35,38
MB08: H30.M2 ; also sheet 6,7,9,14,15,21,22,26,27,30,33,34,36,38
MB09: H30.U2 ; also sheet 2,5,6,9,14,21,22,27,29,30
MB09_: H30.N1 ; also sheet 6,9,18,23,26,27,28,30,33
MB10: H30.L1 HJ31.BJ1 ; also sheet 2,6,8,9,14,21,22,27,29,30,33
MB10_: HJ31.BP1 ; also sheet 6,8,9,18,22,23,26,27,28,30
MB11: H30.A1 ; also sheet 2,6,9,14,21,22,27,29,30,33
OVERFLOW: H30.V1 HJ31.BS1
Unconnected: H30.D1 H30.E1 H30.K1 HJ31.AE2 HJ31.BF1 HJ31.BH1 HJ31.BH2 HJ31.BM1 HJ31.BR1

### Notes on the sheet
- J30
- Clock Control
- D-BS-kw8i-0-1 Real Time Clock Option

## Sheet 38 of 40
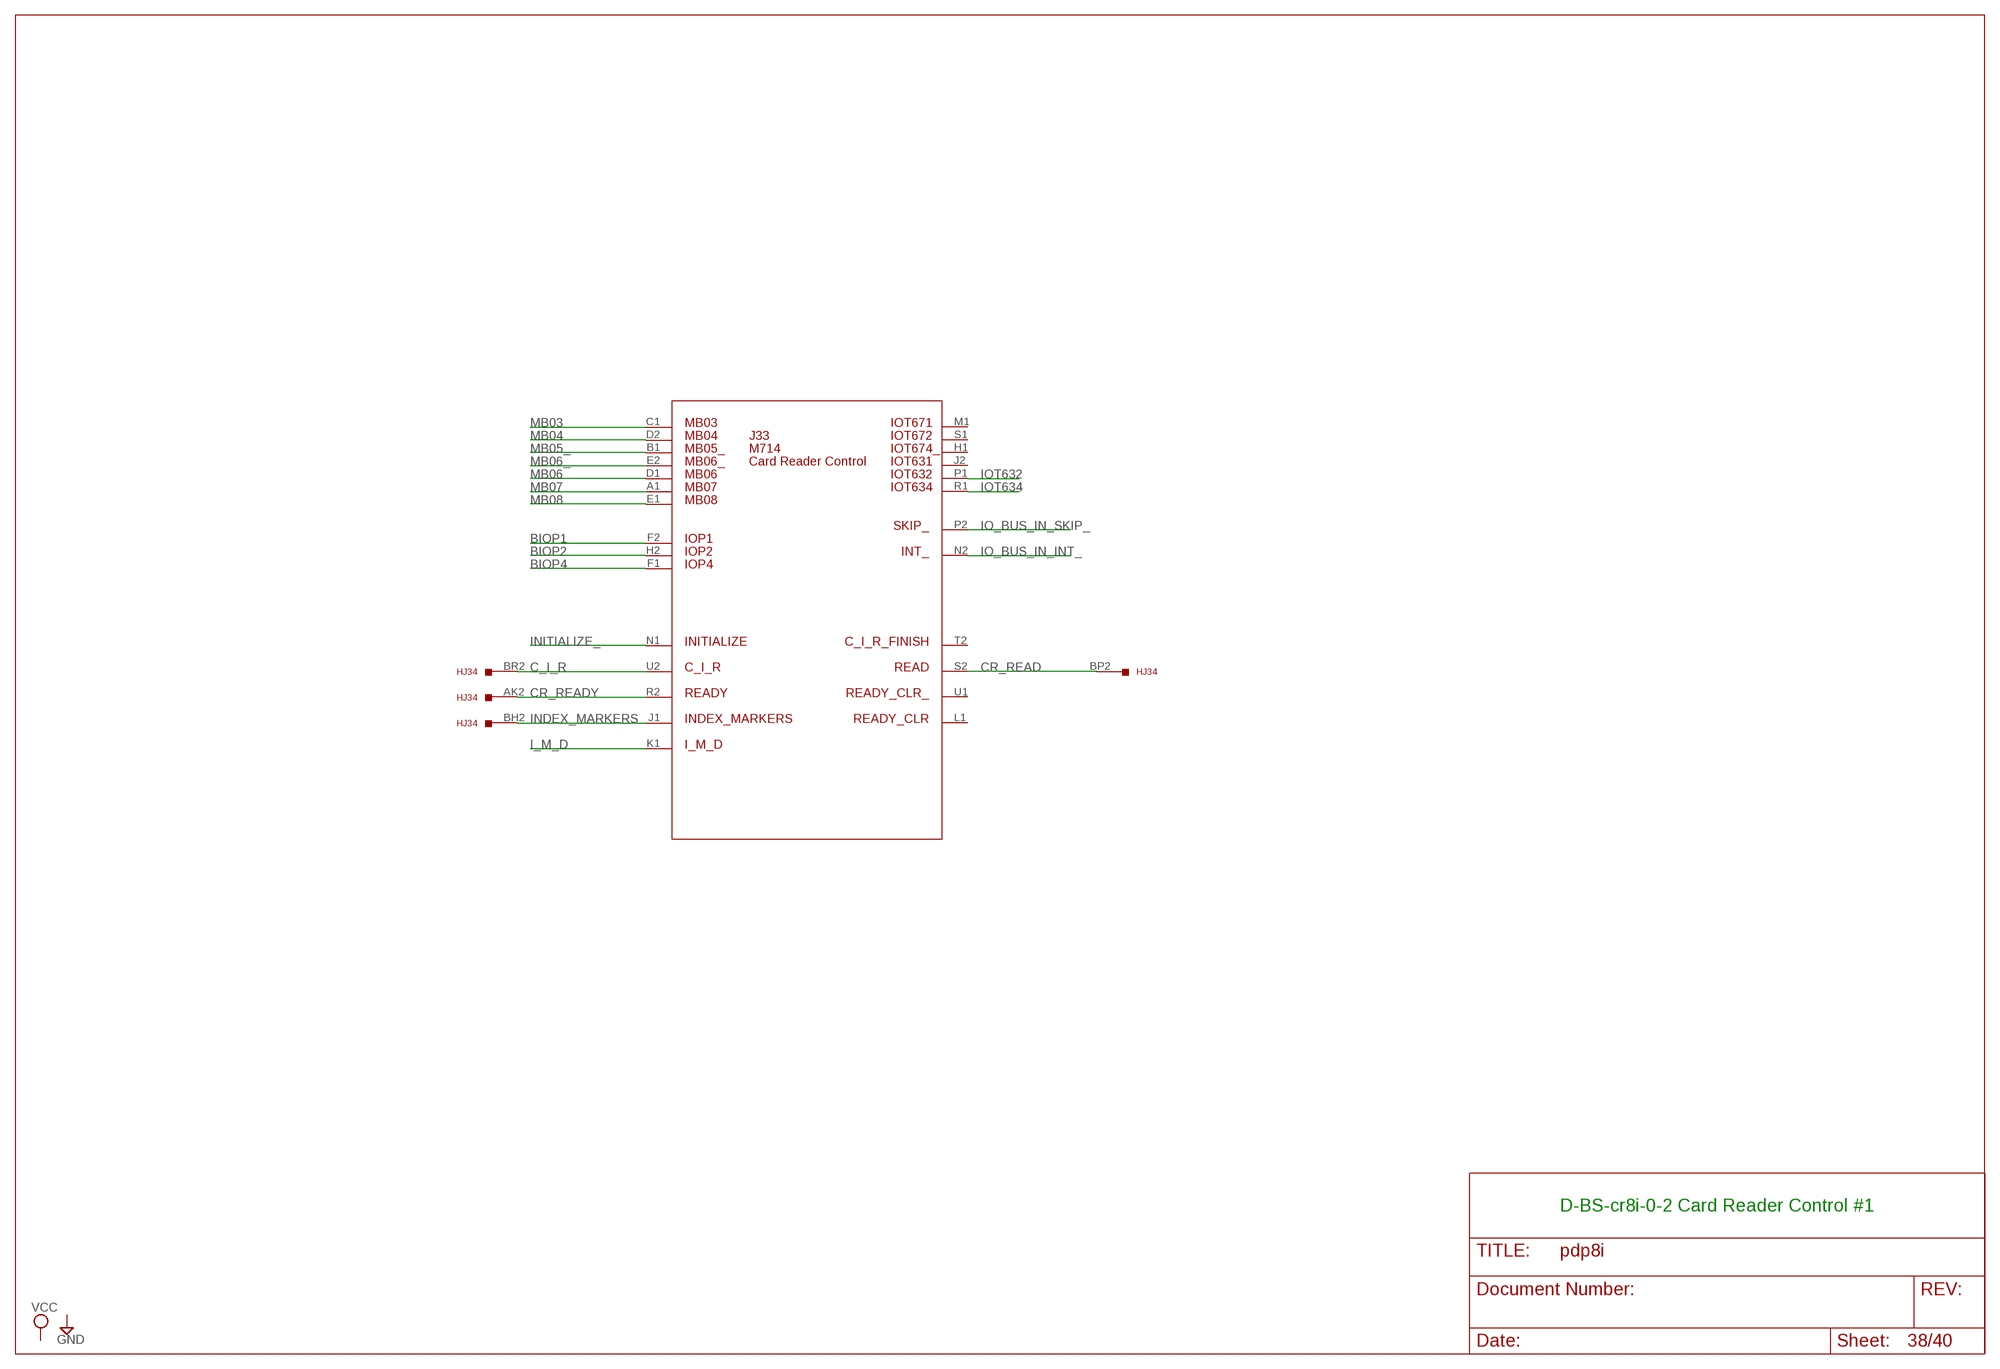
[diagram p38: schematic, sheet 38]

### Parts
HJ34  W991  [H807-2]
J33  M714  [H807]

### Nets
BIOP1: J33.F2 ; also sheet 2
BIOP2: J33.H2 ; also sheet 2
BIOP4: J33.F1 ; also sheet 2
C_I_R: HJ34.BR2 J33.U2
CR_READ: HJ34.BP2 J33.S2
CR_READY: HJ34.AK2 J33.R2
I_M_D: J33.K1 ; also sheet 39
INDEX_MARKERS: HJ34.BH2 J33.J1 ; also sheet 39
INITIALIZE_: J33.N1 ; also sheet 2,14,26,30,32,35,36,37,39
IO_BUS_IN_INT_: J33.N2 ; also sheet 14,33,34,35,36,37
IO_BUS_IN_SKIP_: J33.P2 ; also sheet 14,33,34,35,36,37
IOT632: J33.P1 ; also sheet 39
IOT634: J33.R1 ; also sheet 39
MB03: J33.C1 ; also sheet 4,5,9,14,21,27,29,30,34
MB04: J33.D2 ; also sheet 5,9,14,21,22,30
MB05_: J33.B1 ; also sheet 5,8,9,14,15,16,18,22,23,29,30,33,35,36
MB06: J33.D1 ; also sheet 5,7,9,14,16,21,22,27,30,33
MB06_: J33.E2 ; also sheet 5,8,9,14,15,18,22,23,29,30,32,34,35,36,37
MB07: J33.A1 ; also sheet 5,7,9,14,15,21,22,26,27,30,33,34,35,37
MB08: J33.E1 ; also sheet 6,7,9,14,15,21,22,26,27,30,33,34,36,37
Unconnected: HJ34.AA2 HJ34.AB2 HJ34.AD2 HJ34.AE2 HJ34.AF2 HJ34.AH2 HJ34.AJ2 HJ34.AL2 HJ34.AM2 HJ34.AN2 HJ34.AP2 HJ34.AR2 HJ34.AS2 HJ34.AT2 HJ34.AU2 HJ34.AV2 HJ34.BA2 HJ34.BB2 J33.H1 J33.J2 J33.L1 J33.M1 J33.S1 J33.T2 J33.U1

### Notes on the sheet
- D-BS-cr8i-0-2 Card Reader Control #1

## Sheet 39 of 40
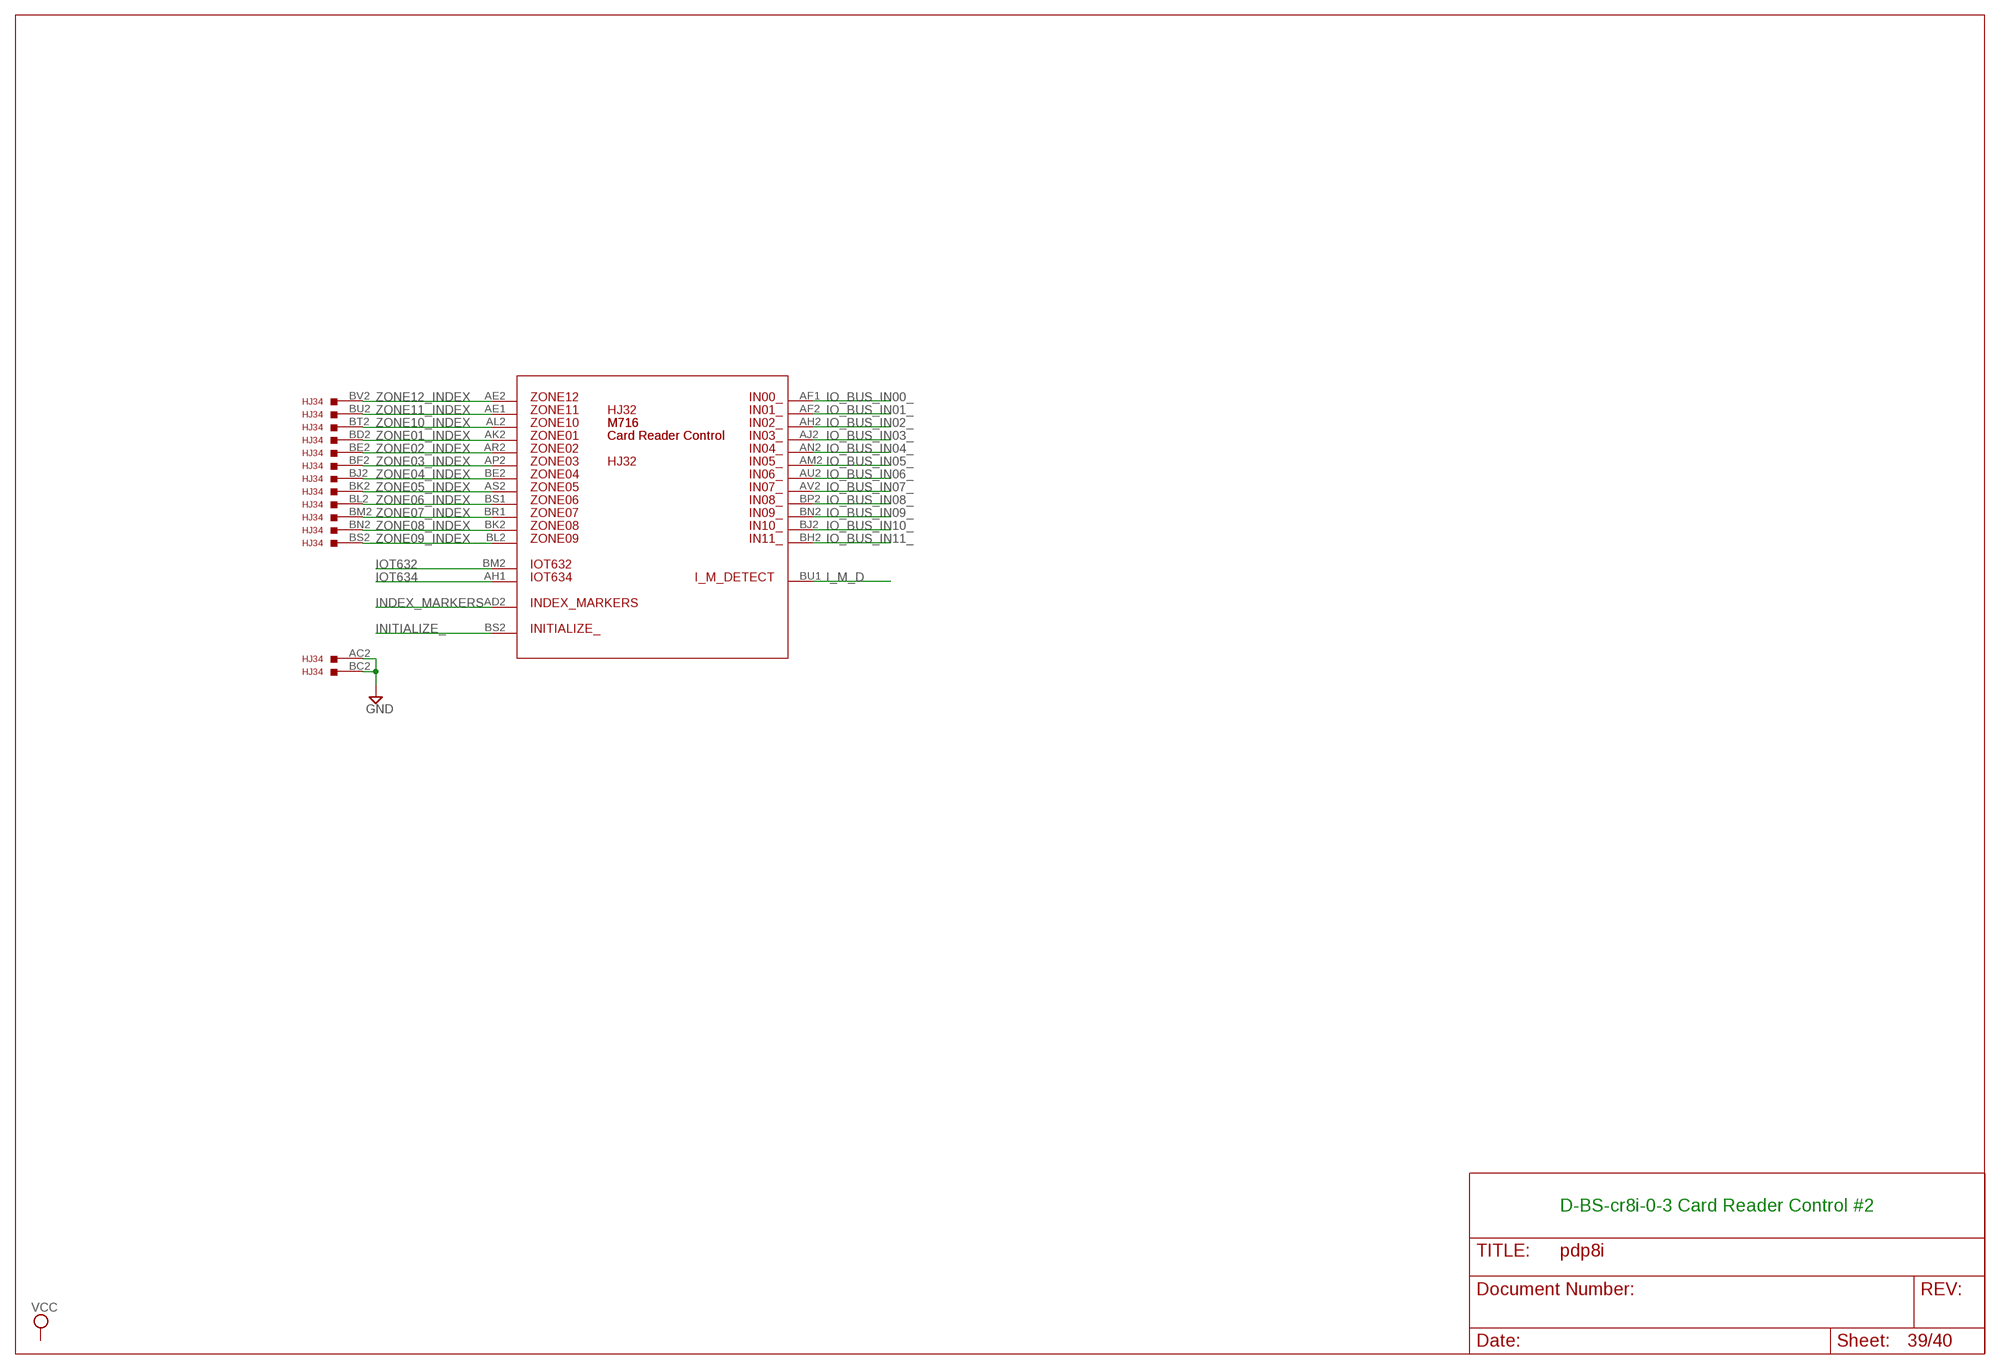
[diagram p39: schematic, sheet 39]

### Parts
HJ32  M716  [H807-2]

### Nets
GND [Suppply]: HJ34.AC2 HJ34.BC2 ; also sheet 2,5,9,10,11,12,13,14,15,17,18,23,26,27,30,33,34,35
I_M_D: HJ32.BU1 ; also sheet 38
INDEX_MARKERS: HJ32.AD2 ; also sheet 38
INITIALIZE_: HJ32.BS2 ; also sheet 2,14,26,30,32,35,36,37,38
IO_BUS_IN00_: HJ32.AF1 ; also sheet 14,37
IO_BUS_IN01_: HJ32.AF2 ; also sheet 14,37
IO_BUS_IN02_: HJ32.AH2 ; also sheet 14,37
IO_BUS_IN03_: HJ32.AJ2 ; also sheet 14,37
IO_BUS_IN04_: HJ32.AN2 ; also sheet 14,36,37
IO_BUS_IN05_: HJ32.AM2 ; also sheet 14,36,37
IO_BUS_IN06_: HJ32.AU2 ; also sheet 14,36,37
IO_BUS_IN07_: HJ32.AV2 ; also sheet 14,36,37
IO_BUS_IN08_: HJ32.BP2 ; also sheet 14,36,37
IO_BUS_IN09_: HJ32.BN2 ; also sheet 14,36,37
IO_BUS_IN10_: HJ32.BJ2 ; also sheet 14,36,37
IO_BUS_IN11_: HJ32.BH2 ; also sheet 14,36,37
IOT632: HJ32.BM2 ; also sheet 38
IOT634: HJ32.AH1 ; also sheet 38
ZONE01_INDEX: HJ32.AK2 HJ34.BD2
ZONE02_INDEX: HJ32.AR2 HJ34.BE2
ZONE03_INDEX: HJ32.AP2 HJ34.BF2
ZONE04_INDEX: HJ32.BE2 HJ34.BJ2
ZONE05_INDEX: HJ32.AS2 HJ34.BK2
ZONE06_INDEX: HJ32.BS1 HJ34.BL2
ZONE07_INDEX: HJ32.BR1 HJ34.BM2
ZONE08_INDEX: HJ32.BK2 HJ34.BN2
ZONE09_INDEX: HJ32.BL2 HJ34.BS2
ZONE10_INDEX: HJ32.AL2 HJ34.BT2
ZONE11_INDEX: HJ32.AE1 HJ34.BU2
ZONE12_INDEX: HJ32.AE2 HJ34.BV2

### Notes on the sheet
- M716
- Card Reader Control
- HJ32
- D-BS-cr8i-0-3 Card Reader Control #2

## Sheet 40 of 40
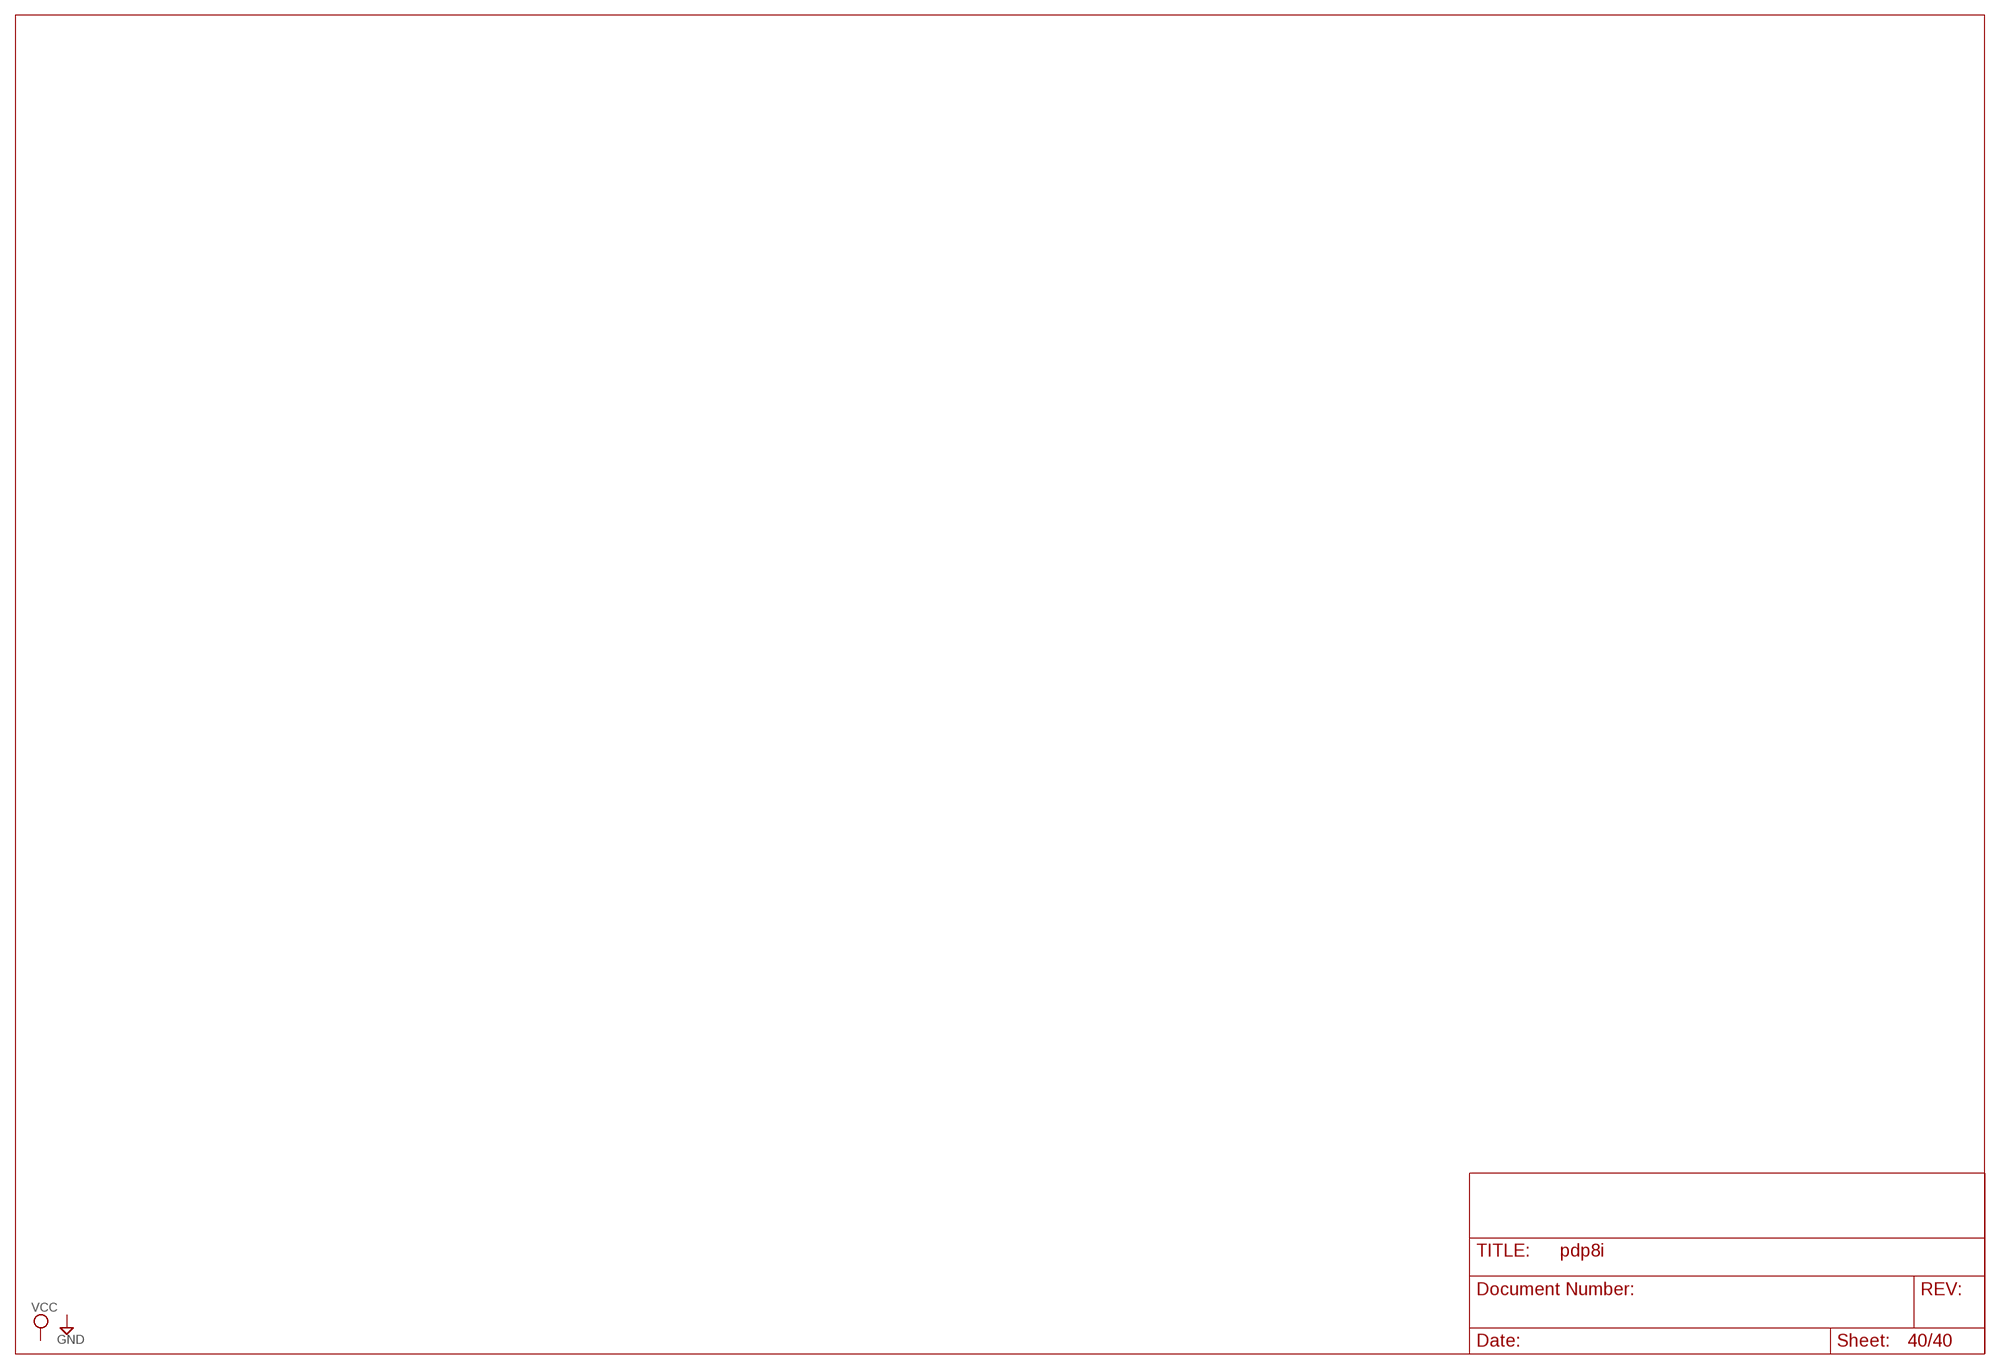
[diagram p40: schematic, sheet 40]

## Power pins joined to a net without a drawn wire
-15V: A30.B2(-15V) A31.B2(-15V) A32.B2(-15V) A33.B2(-15V) AB02.AB2(-15V) AB03.BK2(-15V) AB03.BL2(-15V) AB03.BM2(-15V) AB03.BN2(-15V) AB03.BP2(-15V) AB03.BR2(-15V) AB03.BS2(-15V) AB03.BT2(-15V) AB03.BU2(-15V) AB03.BV2(-15V) B31.B2(-15V) B32.B2(-15V) B33.B2(-15V) C02.B2(-15V) C03.B2(-15V) C04.B2(-15V) C05.B2(-15V) C06.B2(-15V) C07.B2(-15V) E03.B2 E04.B2 E05.B2 E06.B2 E07.B2 E08.B2 F04.B2 F05.B2 F06.B2 F07.B2 H06.B2 H07.B2(-15V) H08.B2(-15V) H09.B2(-15V) H10.B2(-15V) H11.B2(-15V) H12.B2(-15V) H13.B2(-15V) H14.B2(-15V) H15.B2(-15V) H16.B2(-15V) H17.B2(-15V) H18.B2(-15V) H19.B2(-15V) H20.B2(-15V) H21.B2 H22.B2 H33.B2 H35.B2 H36.B2 H37.B2 H38.B2 H39.B2 H40.B2 HJ24.AB2(-15V) HJ24.BB2(-15V) HJ25.AB2(-15V) HJ25.BB2(-15V) HJ27.BB2(-15V) J12.B2(-15V) J13.B2(-15V) J14.B2(-15V) J15.B2(-15V) J16.B2(-15V) J17.B2(-15V) J18.B2(-15V) J19.B2(-15V) J20.B2(-15V) J21.B2 J22.B2 J35.B2 J36.B2 J37.B2 J38.B2 J39.B2 J40.B2
GND: A04.C2(GND) A04.T1(GND) A05.C2(GND) A05.T1(GND) A06.C2(GND) A06.T1(GND) A07.C2(GND) A07.T1(GND) A08.C2(GND) A08.T1(GND) A09.C2(GND) A09.T1(GND) A10.C2(GND) A10.T1(GND) A11.C2(GND) A11.T1(GND) A12.C2(GND) A12.T1(GND) A13.C2(GND) A13.T1(GND) A14.C2(GND) A14.T1(GND) A15.C2(GND) A15.T1(GND) A16.C2(GND) A16.T1(GND) A17.C2(GND) A17.T1(GND) A18.C2(GND) A18.T1(GND) A19.C2(GND) A19.T1(GND) A20.C2(GND) A20.T1(GND) A21.C2(GND) A21.T1(GND) A22.C2(GND) A22.T1(GND) A23.C2(GND) A23.T1(GND) A24.C2(GND) A24.T1(GND) A27.C2(C2:GND) A27.T1(T1:GND) A30.C2(GND) A30.T1(GND) A31.C2(GND) A31.T1(GND) A32.C2(GND) A32.T1(GND) A33.C2(GND) A33.T1(GND) A36.C2(C2:GND) A36.T1(T1:GND) A37.C2(C2:GND) A37.T1(T1:GND) AB02.AC2(GND) AB02.BC2(GND) AB03.AD1(GND) AB03.AE1(GND) AB03.AF1(GND) AB03.AH1(GND) AB03.AJ1(GND) AB03.AK1(GND) AB03.AL1(GND) AB03.AM1(GND) AB03.AN1(GND) AB03.AP1(GND) AB03.AR1(GND) AB03.AS1(GND) AB03.AT1(GND) AB03.AU1(GND) AB03.AV1(GND) AB03.BD1(GND) AB03.BE1(GND) AB03.BF1(GND) AB03.BH1(GND) AB03.BJ1(GND) AB03.BK1(GND) AB03.BL1(GND) AB03.BM1(GND) AB03.BN1(GND) AB03.BP1(GND) AB03.BR1(GND) AB03.BS1(GND) AB03.BT1(GND) AB03.BU1(GND) AB03.BV1(GND) B04.C2(GND) B04.T1(GND) B05.C2(GND) B05.T1(GND) B06.C2(GND) B06.T1(GND) B07.C2(GND) B07.T1(GND) B08.C2(GND) B08.T1(GND) B09.C2(GND) B09.T1(GND) B10.C2(GND) B11.C2(GND) B11.T1(GND) B12.C2(GND) B12.T1(GND) B13.C2(GND) B13.T1(GND) B14.C2(GND) B14.T1(GND) B15.C2(GND) B15.T1(GND) B16.C2(GND) B16.T1(GND) B17.C2(GND) B17.T1(GND) B18.C2(GND) B18.T1(GND) B19.C2(GND) B19.T1(GND) B20.C2(GND) B20.T1(GND) B21.C2(GND) B21.T1(GND) B22.C2(GND) B22.T1(GND) B23.C2(GND) B24.C2(GND) B26.C2(C2:GND) B26.T1(T1:GND) B27.C2(C2:GND) B27.T1(T1:GND) B30.C2(GND) B30.T1(GND) B31.C2(GND) B31.T1(GND) B32.C2(GND) B32.T1(GND) B33.C2(GND) B33.T1(GND) B36.C2(C2:GND) B36.T1(T1:GND) B37.C2(C2:GND) B37.T1(T1:GND) C02.C2(GND) C03.C2(GND) C04.C2(GND) C05.C2(GND) C06.C2(GND) C07.C2(GND) C08.C2(GND) C09.C2(GND) C09.T1(GND) C10.C2(GND) C10.T1(GND) C11.C2(GND) C11.T1(GND) C12.C2(GND) C12.T1(GND) C13.C2(GND) C13.T1(GND) C14.C2(GND) C14.T1(GND) C15.C2(GND) C15.T1(GND) C16.C2(GND) C16.T1(GND) C17.C2(GND) C17.T1(GND) C18.C2(GND) C18.T1(GND) C19.C2(GND) C19.T1(GND) C20.C2(GND) C20.T1(GND) C21.C2(GND) C21.T1(GND) C22.C2(GND) C22.T1(GND) C23.C2(GND) C23.T1(GND) C24.C2(GND) C24.T1(GND) C25.C2(GND) C26.C2(GND) C30.C2(GND) C31.C2(GND) C32.C2(GND) C33.C2(GND) C37.C2(GND) C38.C2(GND) C39.C2(C2:GND) C39.T1(T1:GND) D04.C2 D04.F2 D04.J2 D04.L2 D04.N2 D04.R2 D04.U2 D05.C2(GND) D05.T1(GND) D06.C2(GND) D06.T1(GND) D07.C2(GND) D07.T1(GND) D08.C2(GND) D08.T1(GND) D09.C2(GND) D09.T1(GND) D10.C2(GND) D10.T1(GND) D11.C2(GND) D11.T1(GND) D12.C2(GND) D12.T1(GND) D13.C2(GND) D13.T1(GND) D14.C2(GND) D14.T1(GND) D15.C2(GND) D15.T1(GND) D16.C2(GND) D16.T1(GND) D17.C2(GND) D17.T1(GND) D18.C2(GND) D18.T1(GND) D19.C2(GND) D19.T1(GND) D20.C2(GND) D20.T1(GND) D21.C2(GND) D21.T1(GND) D22.C2(GND) D22.T1(GND) D23.C2(GND) D23.T1(GND) D24.C2(GND) D24.T1(GND) D25.C2(GND) D26.C2(GND) D30.C2(GND) D31.C2(GND) D32.C2(GND) D33.C2(GND) D37.C2(GND) D38.C2(GND) D39.C2(C2:GND) D39.T1(T1:GND) E03.C2 E04.C2 E05.C2 E06.C2 E07.C2 E08.C2 E09.C2(GND) E09.T1(GND) E11.C2(GND) E11.T1(GND) E12.C2(GND) E12.T1(GND) E13.C2(GND) E13.T1(GND) E14.C2(GND) E14.T1(GND) E15.C2(GND) E15.T1(GND) E16.C2(GND) E16.T1(GND) E17.C2(GND) E17.T1(GND) E18.C2(GND) E18.T1(GND) E19.C2(GND) E19.T1(GND) E20.C2(GND) E20.T1(GND) E21.C2(GND) E21.T1(GND) E22.C2(GND) E22.T1(GND) E23.C2(GND) E23.T1(GND) E24.C2(GND) E24.T1(GND) E25.C2(GND) E25.T1(GND) E26.C2(GND) E26.T1(GND) E27.C2(GND) E27.T1(GND) E28.C2(GND) E28.T1(GND) E29.C2(GND) E29.T1(GND) E30.C2(GND) E30.T1(GND) E31.C2(GND) E31.T1(GND) E32.C2(GND) E32.T1(GND) E33.C2(GND) E33.T1(GND) EF01.AC2(GND) EF01.AT1(GND) EF01.BC2(GND) EF01.BT1(GND) EF02.AC2(GND) EF02.AT1(GND) EF02.BC2(GND) EF02.BT1(GND) EF10.AC2(GND) EF10.BC2(GND) EF34.AC2(GND) EF34.AT1(GND) EF34.BC2(GND) EF34.BT1(GND) EF35.AC2(GND) EF35.AT1(GND) EF35.BC2(GND) EF35.BT1(GND) EF36.AC2(GND) EF36.AT1(GND) EF36.BC2(GND) EF36.BT1(GND) EF37.AC2(GND) EF37.AT1(GND) EF37.BC2(GND) EF37.BT1(GND) EF38.AC2(GND) EF38.AT1(GND) EF38.BC2(GND) EF38.BT1(GND) EF39.AC2(GND) EF39.AT1(GND) EF39.BC2(GND) EF39.BT1(GND) F03.C2(GND) F04.C2 F05.C2 F06.C2 F07.C2 F08.C2(GND) F09.C2(GND) F09.T1(GND) F11.C2(GND) F11.T1(GND) F12.C2(GND) F12.T1(GND) F13.C2(GND) F13.T1(GND) F14.C2(GND) F14.T1(GND) F15.C2(GND) F15.T1(GND) F16.C2(GND) F16.T1(GND) F17.C2(GND) F17.T1(GND) F18.C2(GND) F18.T1(GND) F19.C2(GND) F19.T1(GND) F20.C2(GND) F20.T1(GND) F21.C2(GND) F21.T1(GND) F22.C2(GND) F22.T1(GND) F23.C2(GND) F23.T1(GND) F24.C2(GND) F24.T1(GND) F25.C2(GND) F25.T1(GND) F26.C2(GND) F26.T1(GND) F27.C2(GND) F27.T1(GND) F28.C2(GND) F28.T1(GND) F29.C2(GND) F29.T1(GND) F30.C2(GND) F30.T1(GND) F31.C2(GND) F31.T1(GND) F32.C2(GND) F32.T1(GND) F33.C2(GND) F33.T1(GND) H01.C2 H01.F2 H01.J2 H01.L2 H01.N2 H01.R2 H01.U2 H02.C2 H02.F2 H02.J2 H02.L2 H02.N2 H02.R2 H02.U2 H03.C2 H03.F2 H03.J2 H03.L2 H03.N2 H03.R2 H03.U2 H04.C2 H04.F2 H04.J2 H04.L2 H04.N2 H04.R2 H04.U2 H05.C2 H05.F2 H05.J2 H05.L2 H05.N2 H05.R2 H05.U2 H06.C2 H07.C2(GND) H08.C2(GND) H09.C2(GND) H10.C2(GND) H11.C2(GND) H12.C2(GND) H13.C2(GND) H14.C2(GND) H15.C2(GND) H16.C2(GND) H17.C2(GND) H18.C2(GND) H19.C2(GND) H20.C2(GND) H21.C2 H22.C2 H30.C2(GND) H30.T1(GND) H33.C2 H35.C2 H36.C2 H37.C2 H38.C2 H39.C2 H40.C2 HJ23.AC2(GND) HJ23.AT1(GND) HJ23.BC2(GND) HJ23.BT1(GND) HJ24.AC2(GND) HJ24.BC2(GND) HJ25.AC2(GND) HJ25.BC2(GND) HJ26.AC2(GND) HJ26.AT1(GND) HJ26.BC2(GND) HJ26.BT1(GND) HJ27.AC2(GND) HJ27.BC2(GND) HJ28.AC2(GND) HJ28.AT1(GND) HJ28.BC2(GND) HJ28.BT1(GND) HJ29.AC2(GND) HJ29.AT1(GND) HJ29.BC2(GND) HJ29.BT1(GND) HJ31.AC2(GND) HJ31.AT1(GND) HJ31.BC2(GND) HJ31.BT1(GND) HJ32.AC2(GND) HJ32.AT1(GND) HJ32.BC2(GND) HJ32.BT1(GND) J01.C2 J01.F2 J01.J2 J01.L2 J01.N2 J01.R2 J01.U2 J02.C2 J02.F2 J02.J2 J02.L2 J02.N2 J02.R2 J02.U2 J03.C2 J03.F2 J03.J2 J03.L2 J03.N2 J03.R2 J03.U2 J04.C2 J04.F2 J04.J2 J04.L2 J04.N2 J04.R2 J04.U2 J05.C2 J05.F2 J05.J2 J05.L2 J05.N2 J05.R2 J05.U2 J06.C2 J06.F2 J06.J2 J06.L2 J06.N2 J06.R2 J06.U2 J07.C2 J07.F2 J07.J2 J07.L2 J07.N2 J07.R2 J07.U2 J08.C2 J08.F2 J08.J2 J08.L2 J08.N2 J08.R2 J08.U2 J09.C2 J09.F2 J09.J2 J09.L2 J09.N2 J09.R2 J09.U2 J10.C2 J10.F2 J10.J2 J10.L2 J10.N2 J10.R2 J10.U2 J11.C2 J11.F2 J11.J2 J11.L2 J11.N2 J11.R2 J11.U2 J12.C2(GND) J13.C2(GND) J13.T1(GND) J14.C2(GND) J14.T1(GND) J15.C2(GND) J15.T1(GND) J16.C2(GND) J16.T1(GND) J17.C2(GND) J17.T1(GND) J18.C2(GND) J18.T1(GND) J19.C2(GND) J19.T1(GND) J20.C2(GND) J20.T1(GND) J21.C2 J22.C2 J30.C2(GND) J33.C2(GND) J33.T1(GND) J35.C2 J36.C2 J37.C2 J38.C2 J39.C2 J40.C2
VCC: A04.A2(VCC) A05.A2(VCC) A06.A2(VCC) A07.A2(VCC) A08.A2(VCC) A09.A2(VCC) A10.A2(VCC) A11.A2(VCC) A12.A2(VCC) A13.A2(VCC) A14.A2(VCC) A15.A2(VCC) A16.A2(VCC) A17.A2(VCC) A18.A2(VCC) A19.A2(VCC) A20.A2(VCC) A21.A2(VCC) A22.A2(VCC) A23.A2(VCC) A24.A2(VCC) A27.A2(C2:VCC) A30.A2(VCC) A31.A2(VCC) A32.A2(VCC) A33.A2(VCC) A36.A2(C2:VCC) A37.A2(C2:VCC) AB02.AA2(VCC) AB02.BA2(VCC) AB03.AD2(VCC) AB03.AE2(VCC) AB03.AF2(VCC) AB03.AH2(VCC) AB03.AJ2(VCC) AB03.AK2(VCC) AB03.AL2(VCC) AB03.AM2(VCC) AB03.AN2(VCC) AB03.AP2(VCC) AB03.AR2(VCC) AB03.AS2(VCC) AB03.AT2(VCC) AB03.AU2(VCC) AB03.AV2(VCC) AB03.BD2(VCC) AB03.BE2(VCC) AB03.BF2(VCC) AB03.BH2(VCC) AB03.BJ2(VCC) B04.A2(VCC) B05.A2(VCC) B06.A2(VCC) B07.A2(VCC) B08.A2(VCC) B09.A2(VCC) B10.A2(VCC) B11.A2(VCC) B12.A2(VCC) B13.A2(VCC) B14.A2(VCC) B15.A2(VCC) B16.A2(VCC) B17.A2(VCC) B18.A2(VCC) B19.A2(VCC) B20.A2(VCC) B21.A2(VCC) B22.A2(VCC) B23.A2(VCC) B24.A2(VCC) B26.A2(C2:VCC) B27.A2(C2:VCC) B30.A2(VCC) B31.A2(VCC) B32.A2(VCC) B33.A2(VCC) B36.A2(C2:VCC) B37.A2(C2:VCC) C02.A2(VCC) C03.A2(VCC) C04.A2(VCC) C05.A2(VCC) C06.A2(VCC) C07.A2(VCC) C08.A2(VCC) C09.A2(VCC) C10.A2(VCC) C11.A2(VCC) C12.A2(VCC) C13.A2(VCC) C14.A2(VCC) C15.A2(VCC) C16.A2(VCC) C17.A2(VCC) C18.A2(VCC) C19.A2(VCC) C20.A2(VCC) C21.A2(VCC) C22.A2(VCC) C23.A2(VCC) C24.A2(VCC) C25.A2(VCC) C26.A2(VCC) C30.A2(VCC) C31.A2(VCC) C32.A2(VCC) C33.A2(VCC) C37.A2(VCC) C38.A2(VCC) C39.A2(C2:VCC) D05.A2(VCC) D06.A2(VCC) D07.A2(VCC) D08.A2(VCC) D09.A2(VCC) D10.A2(VCC) D11.A2(VCC) D12.A2(VCC) D13.A2(VCC) D14.A2(VCC) D15.A2(VCC) D16.A2(VCC) D17.A2(VCC) D18.A2(VCC) D19.A2(VCC) D20.A2(VCC) D21.A2(VCC) D22.A2(VCC) D23.A2(VCC) D24.A2(VCC) D25.A2(VCC) D26.A2(VCC) D30.A2(VCC) D31.A2(VCC) D32.A2(VCC) D33.A2(VCC) D37.A2(VCC) D38.A2(VCC) D39.A2(C2:VCC) E03.A2 E04.A2 E05.A2 E06.A2 E07.A2 E08.A2 E09.A2(VCC) E11.A2(VCC) E12.A2(VCC) E13.A2(VCC) E14.A2(VCC) E15.A2(VCC) E16.A2(VCC) E17.A2(VCC) E18.A2(VCC) E19.A2(VCC) E20.A2(VCC) E21.A2(VCC) E22.A2(VCC) E23.A2(VCC) E24.A2(VCC) E25.A2(VCC) E26.A2(VCC) E27.A2(VCC) E28.A2(VCC) E29.A2(VCC) E30.A2(VCC) E31.A2(VCC) E32.A2(VCC) E33.A2(VCC) EF01.AA2(VCC) EF01.BA2(VCC) EF02.AA2(VCC) EF02.BA2(VCC) EF10.AA2(VCC) EF10.BA2(VCC) EF34.AA2(VCC) EF34.BA2(VCC) EF35.AA2(VCC) EF35.BA2(VCC) EF36.AA2(VCC) EF36.BA2(VCC) EF37.AA2(VCC) EF37.BA2(VCC) EF38.AA2(VCC) EF38.BA2(VCC) EF39.AA2(VCC) EF39.BA2(VCC) F03.A2(VCC) F04.A2 F05.A2 F06.A2 F07.A2 F08.A2(VCC) F09.A2(VCC) F11.A2(VCC) F12.A2(VCC) F13.A2(VCC) F14.A2(VCC) F15.A2(VCC) F16.A2(VCC) F17.A2(VCC) F18.A2(VCC) F19.A2(VCC) F20.A2(VCC) F21.A2(VCC) F22.A2(VCC) F23.A2(VCC) F24.A2(VCC) F25.A2(VCC) F26.A2(VCC) F27.A2(VCC) F28.A2(VCC) F29.A2(VCC) F30.A2(VCC) F31.A2(VCC) F32.A2(VCC) F33.A2(VCC) H06.A2 H07.A2(VCC) H08.A2(VCC) H09.A2(VCC) H10.A2(VCC) H11.A2(VCC) H12.A2(VCC) H13.A2(VCC) H14.A2(VCC) H15.A2(VCC) H16.A2(VCC) H17.A2(VCC) H18.A2(VCC) H19.A2(VCC) H20.A2(VCC) H21.A2 H22.A2 H30.A2(VCC) H33.A2 H35.A2 H36.A2 H37.A2 H38.A2 H39.A2 H40.A2 HJ23.AA2(VCC) HJ23.BA2(VCC) HJ24.AA2(VCC) HJ24.BA2(VCC) HJ25.AA2(VCC) HJ25.BA2(VCC) HJ26.AA2(VCC) HJ26.BA2(VCC) HJ27.AA2(VCC) HJ27.BA2(VCC) HJ28.AA2(VCC) HJ28.BA2(VCC) HJ29.AA2(VCC) HJ29.BA2(VCC) HJ31.AA2(VCC) HJ31.BA2(VCC) HJ32.AA2(VCC) HJ32.BA2(VCC) J12.A2(VCC) J13.A2(VCC) J14.A2(VCC) J15.A2(VCC) J16.A2(VCC) J17.A2(VCC) J18.A2(VCC) J19.A2(VCC) J20.A2(VCC) J21.A2 J22.A2 J30.A2(VCC) J33.A2(VCC) J35.A2 J36.A2 J37.A2 J38.A2 J39.A2 J40.A2

## Library data of the parts
A04 = dec-m:M703: M703 Power Fail and Restart
A05 A06 A11-A19 B06 B08 B09 B21 C09 C10 C14-C18 D07 D12-D16 E09 E11 E12 E15 E22 E24 F20-F22 F25 F29 F32 = dec-m:M113: 10 2-input NAND Gates
A07-A09 A10 = dec-m:M162: Parity Circuit
A20 B04 B07 B20 C11 C19-C21 D09 D17-D19 E14 E21 E25 F26 F28 = dec-m:M115: 8 3-input NAND Gates
A21-A24 C13 D06 D08 E16 E17 F12-F18 = dec-m:M310: Tapped Delay Line
A25 A26 A38 A39 B25 B38 B39 = dec-m:G624: Resistor Board
A27 A36 A37 B26 B27 B36 B37 C39 D39 = dec-m:G228: Inhibit Driver
A30-A33 B31-B33 = dec-m:G021: Sense Amps
A40 B40 C40 D40 E40 F40 = dec-m:M916: Simple 36 pin connector/wire cable
AB01 = dec-m:G805: Negative Regulator
AB02 = dec-m:G826: Regulator and Power Detector
AB03 = dec-m:G792: Power Supply Connector
AB28 AB29 AB34 AB35 = dec-m:W025: Core memory cable.
B05 B11 B17-B19 C22-C24 D11 D24 = dec-m:M216: Two sets of 3 D flip-flops
B10 = dec-m:M720: M720 Memory Detection
B12-B16 B30 C12 D22 E31 E32 F30 F31 = dec-m:M617: 6 4-input NAND Buffers
B22 E18-E20 E23 E33 = dec-m:M206X: Two sets of 3 D flip-flops
B23 B24 = dec-m:M360: Variable Delay
C01 D01-D03 = dec-m:W023: One-sided 18 pin connector/cable.
C02-C06 = dec-m:M040: M040 Solenoid Driver
C07 = dec-m:M661: Positive Level Driver
C08 F08 = dec-m:M660: Positive Level Driver
C25 C26 C30-C33 C37 C38 D25 D26 D30-D33 D37 D38 = dec-m:G221: Memory Selector
C28 C35 D28 D35 = dec-m:H807: Empty card slot
CD27 CD29 CD34 CD36 = dec-m:G610: G610 Core Connector
D04 H01-H05 J01-J09 J10 J11 = dec-m:W011: One-sided 9 pin connector/cable with grounds (Negibus).
D05 = dec-m:M516: Hex Positive Bus Receiver
D10 D20 D21 F11 F19 F23 F24 F27 = dec-m:M117: 6 4-input NAND Gates
D23 E13 E26-E30 F33 = dec-m:M160: AND-NOR Gates
E03-E08 F04-F07 H06 H21 H22 H33 H35-H40 J21 J22 J35-J40 = dec-m:EMPTY: Empty Slot
EF01 = dec-m:M706: M706 TTY Receiver
EF02 = dec-m:M707: M707 TTY Transmitter
EF10 = dec-m:M700: Manual Function Timing and Run
EF34-EF39 = dec-m:M220: PDP-8 Major Registers
F03 = dec-m:M452: M452 Baud Rate Clock
F09 = dec-m:M119: 3 8-input NAND Gates
H07-H09 H10-H20 = dec-m:M650
H30 = dec-m:M708: M708 Clock Control
HJ23 = dec-m:M701: M701 Display Control
HJ24 HJ25 = dec-m:A607: A607 Digital to Analog Converter
HJ26 = dec-m:M705: Reader Control
HJ27 = dec-m:M715: Reader Clock
HJ28 = dec-m:M710: Punch Control
HJ29 = dec-m:M704: M704 Plotter Control
HJ31 = dec-m:M709: M709 Clock Counter
HJ32 = dec-m:M716: M716 Card Reader Control
HJ34 = dec-m:W991: One-sided 36 pin (double hight) connector/cable.
J12 = dec-m:W076: W076 Terminal Connector
J13-J20 = dec-m:M506: Hex Negative Bus Receiver
J30 = dec-m:M501: M401/M405/M501 Frequency Source
J33 = dec-m:M714: M714 Card Reader Control

## Net classes
1 Suppply: width 1.016 mm